# EAGLE design eae-pld-x (EAGLE 6.6.0)
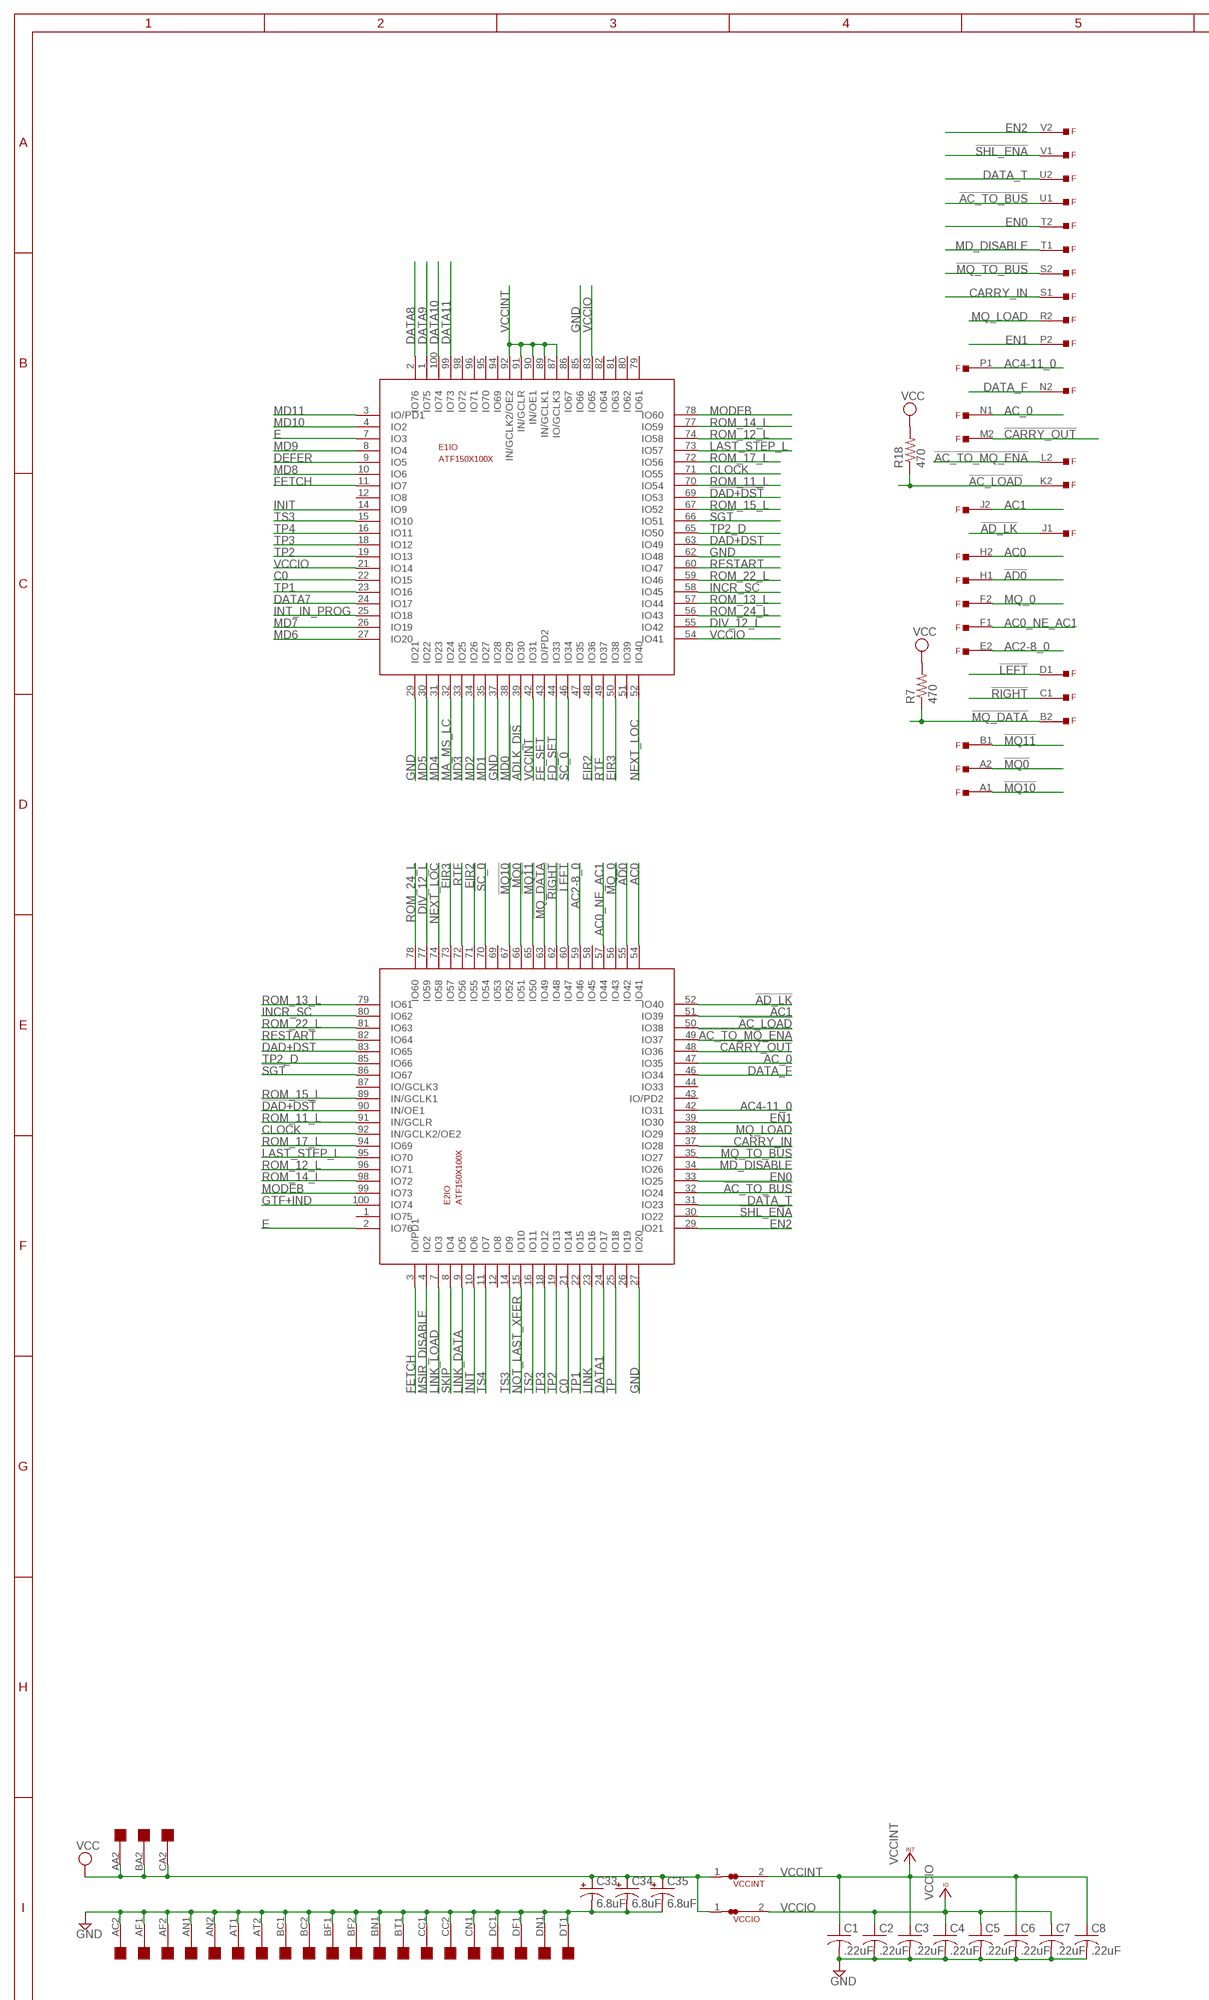
[diagram p0: schematic, sheet 1, part 1 of 2]
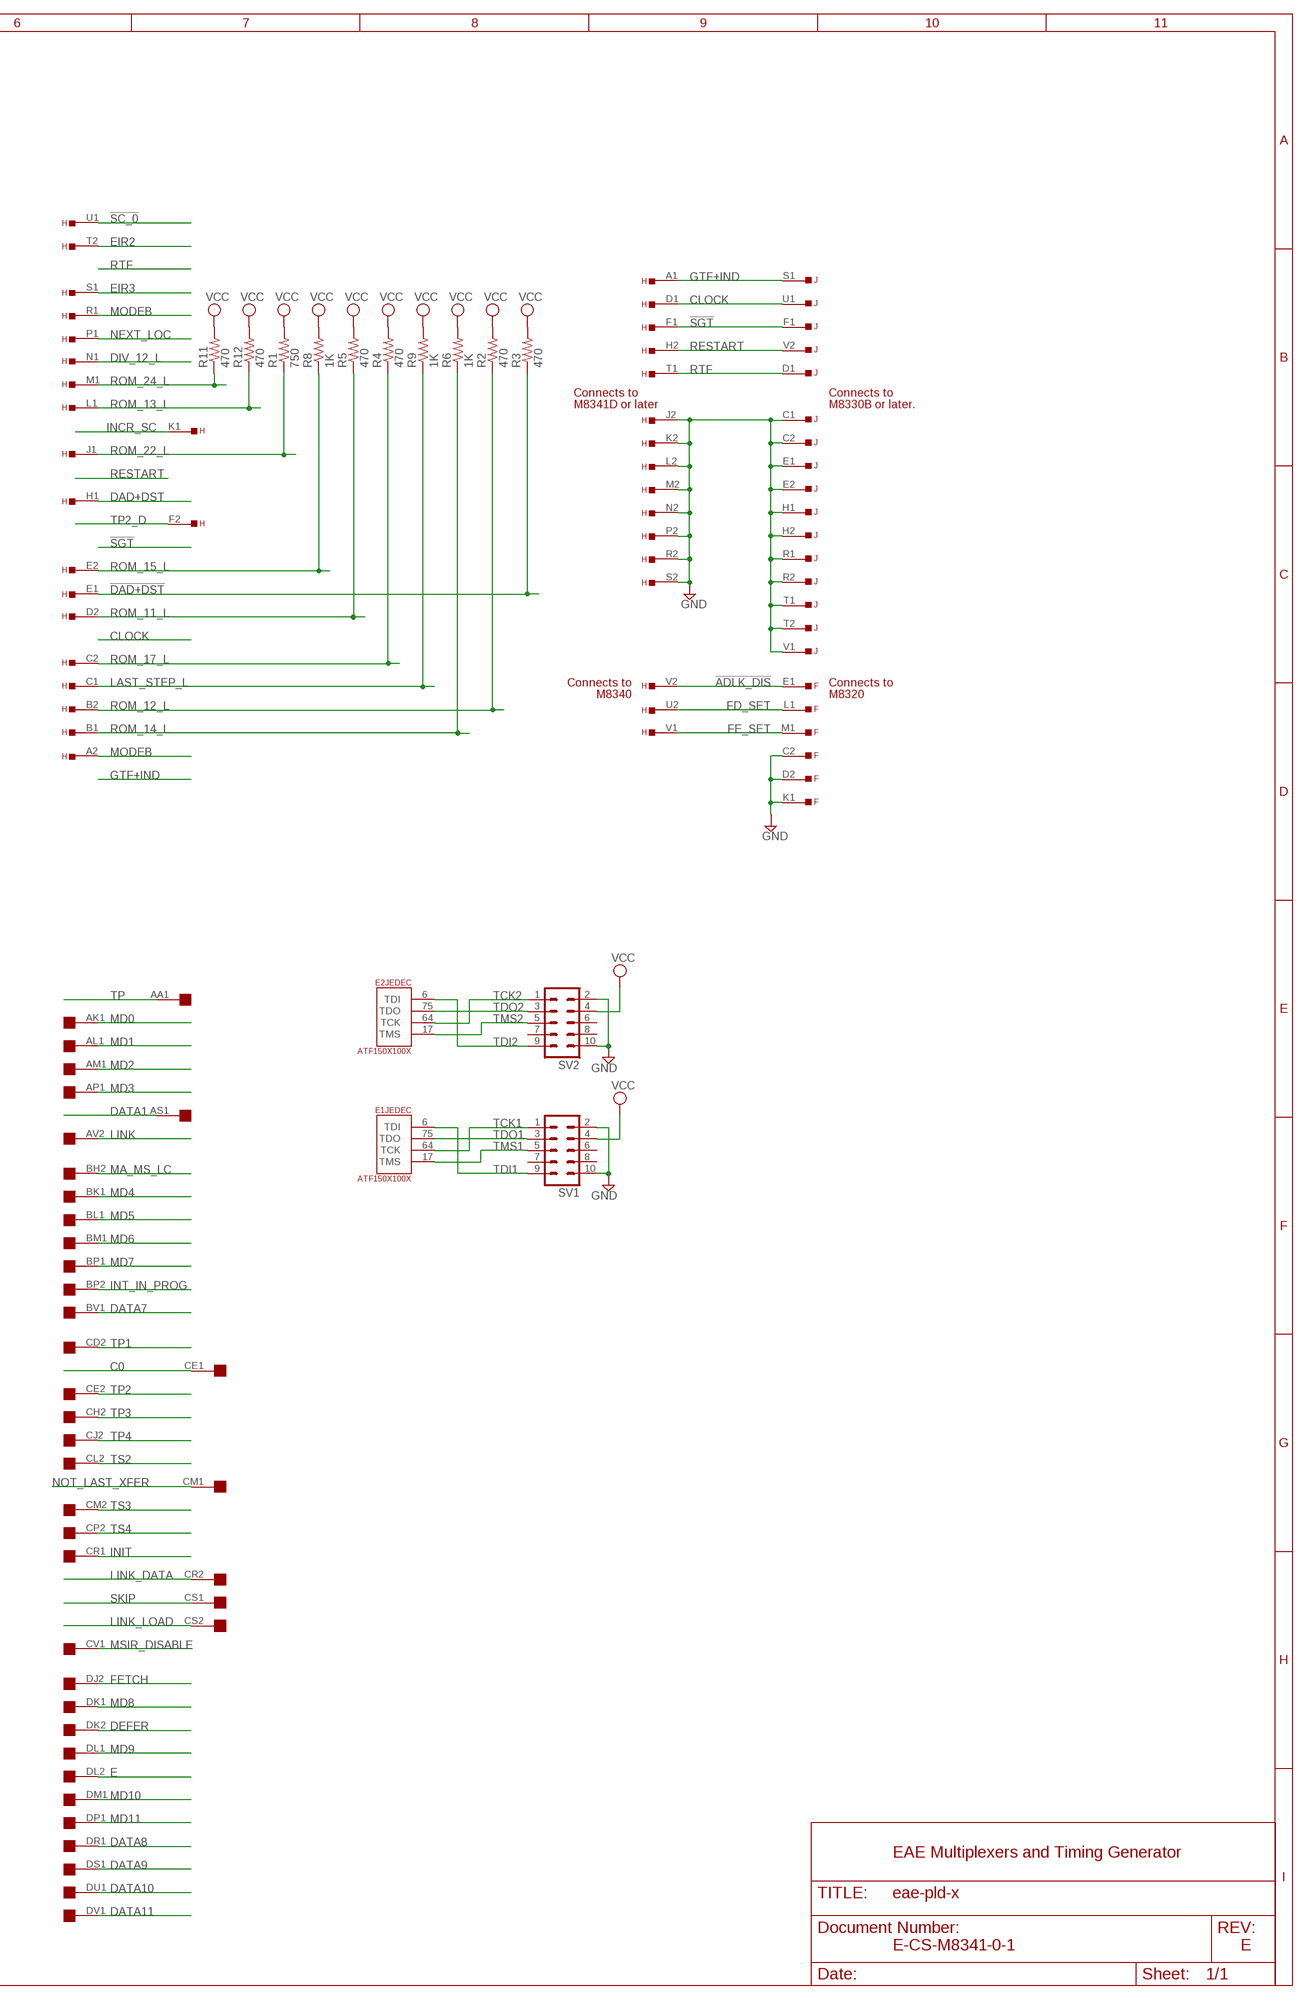
[diagram p1: schematic, sheet 1, part 2 of 2]

## Parts
C1  .22uF  C-US  [C063-025X075]
C2  .22uF  C-US  [C063-025X075]
C3  .22uF  C-US  [C063-025X075]
C4  .22uF  C-US  [C063-025X075]
C5  .22uF  C-US  [C063-025X075]
C6  .22uF  C-US  [C063-025X075]
C7  .22uF  C-US  [C063-025X075]
C8  .22uF  C-US  [C063-025X075]
C33  6.8uF  CPOL-USE20-8AXIAL  [E12-8]
C34  6.8uF  CPOL-USE20-8AXIAL  [E12-8]
C35  6.8uF  CPOL-USE20-8AXIAL  [E12-8]
E1  ATF150X100X  [TH100B]
E2  ATF150X100X  [TH100B]
F  EDGE-TOP  [EDGE-CON2]
H  EDGE-TOP  [EDGE-CON2]
J  EDGE-TOP  [EDGE-CON2]
R1  750  R-US_0207/10  [0207/10]
R2  470  R-US_0207/10  [0207/10]
R3  470  R-US_0207/10  [0207/10]
R4  470  R-US_0207/10  [0207/10]
R5  470  R-US_0207/10  [0207/10]
R6  1K  R-US_0207/10  [0207/10]
R7  470  R-US_0207/10  [0207/10]
R8  1K  R-US_0207/10  [0207/10]
R9  1K  R-US_0207/10  [0207/10]
R11  470  R-US_0207/10  [0207/10]
R12  470  R-US_0207/10  [0207/10]
R18  470  R-US_0207/10  [0207/10]
SV1  ML10  [ML10]
SV2  ML10  [ML10]
U$1  QUAD  [EDGE-CON8]
VCCINT  JUMPER-NC1  [NC1]
VCCIO  JUMPER-NC1  [NC1]

## Nets
!AC_LOAD: E2.50(IO:IO38) F.K2 R18.1
!AC_TO_BUS: E2.32(IO:IO24) F.U1
!AC_TO_MQ_ENA: E2.49(IO:IO37) F.L2
!AD0: E2.55(IO:IO42) F.H1
!AD_LK: E2.52(IO:IO40) F.J1
!ADLK_DIS: E1.39(IO:IO30) F.E1 H.V2
!CARRY_OUT: E2.48(IO:IO36) F.M2
!DAD+DST: E1.69(IO:IO53) E2.90(IO:IN/OE1) H.E1 R3.1
!LEFT: E2.60(IO:IO47) F.D1
!MQ0: E2.66(IO:IO51) F.A2
!MQ10: E2.67(IO:IO52) F.A1
!MQ11: E2.65(IO:IO50) F.B1
!MQ_DATA: E2.63(IO:IO49) F.B2 R7.1
!MQ_TO_BUS: E2.35(IO:IO27) F.S2
!RIGHT: E2.62(IO:IO48) F.C1
!SC_0: E1.46(IO:IO34) E2.70(IO:IO54) H.U1
!SGT: E1.66(IO:IO51) E2.86(IO:IO67) H.F1 J.F1
!SHL_ENA: E2.30(IO:IO22) F.V1
AC0: E2.54(IO:IO41) F.H2
AC0_NE_AC1: E2.57(IO:IO44) F.F1
AC1: E2.51(IO:IO39) F.J2
AC2-8_0: E2.59(IO:IO46) F.E2
AC4-11_0: E2.42(IO:IO31) F.P1
AC_0: E2.47(IO:IO35) F.N1
C0: E1.22(IO:IO15) E2.21(IO:IO14) U$1.CE1
CARRY_IN: E2.37(IO:IO28) F.S1
CLOCK: E1.71(IO:IO55) E2.92(IO:IN/GCLK2/OE2) H.D1 J.U1
DAD+DST: E1.63(IO:IO49) E2.83(IO:IO65) H.H1
DATA1: E2.24(IO:IO17) U$1.AS1
DATA7: E1.24(IO:IO17) U$1.BV1
DATA8: E1.2(IO:IO76) U$1.DR1
DATA9: E1.1(IO:IO75) U$1.DS1
DATA10: E1.100(IO:IO74) U$1.DU1
DATA11: E1.99(IO:IO73) U$1.DV1
DATA_F: E2.46(IO:IO34) F.N2
DATA_T: E2.31(IO:IO23) F.U2
DEFER: E1.9(IO:IO5) U$1.DK2
DIV_12_L: E1.55(IO:IO42) E2.77(IO:IO59) H.N1
E: E1.7(IO:IO3) E2.2(IO:IO76) U$1.DL2
EIR2: E1.48(IO:IO36) E2.71(IO:IO55) H.T2
EIR3: E1.50(IO:IO38) E2.73(IO:IO57) H.S1
EN0: E2.33(IO:IO25) F.T2
EN1: E2.39(IO:IO30) F.P2
EN2: E2.29(IO:IO21) F.V2
FD_SET: E1.44(IO:IO33) F.L1 H.U2
FE_SET: E1.43(IO:IO/PD2) F.M1 H.V1
FETCH: E1.11(IO:IO7) E2.3(IO:IO/PD1) U$1.DJ2
GND [supply]: C1.2 C2.2 C3.2 C4.2 C5.2 C6.2 C7.2 C8.2 C33.- C34.- C35.- E1.29(IO:IO21) E1.37(IO:IO28) E1.62(IO:IO48) E1.85(IO:IO66) E2.27(IO:IO20) F.C2 F.D2 F.K1 H.J2 H.K2 H.L2 H.M2 H.N2 H.P2 H.R2 H.S2 J.C1 J.C2 J.E1 J.E2 J.H1 J.H2 J.R1 J.R2 J.T1 J.T2 J.V1 SV1.2 SV1.10 SV2.2 SV2.10 U$1.AC2 U$1.AF1 U$1.AF2 U$1.AN1 U$1.AN2 U$1.AT1 U$1.AT2 U$1.BC1 U$1.BC2 U$1.BF1 U$1.BF2 U$1.BN1 U$1.BT1 U$1.CC1 U$1.CC2 U$1.CN1 U$1.DC1 U$1.DF1 U$1.DN1 U$1.DT1
GTF+IND: E2.100(IO:IO74) H.A1 J.S1
INCR_SC: E1.58(IO:IO45) E2.80(IO:IO62) H.K1
INIT: E1.14(IO:IO9) E2.10(IO:IO6) U$1.CR1
INT_IN_PROG: E1.25(IO:IO18) U$1.BP2
LAST_STEP_L: E1.73(IO:IO57) E2.95(IO:IO70) H.C1 R9.1
LINK: E2.23(IO:IO16) U$1.AV2
LINK_DATA: E2.9(IO:IO5) U$1.CR2
LINK_LOAD: E2.7(IO:IO3) U$1.CS2
MA_MS_LC: E1.32(IO:IO24) U$1.BH2
MD0: E1.38(IO:IO29) U$1.AK1
MD1: E1.35(IO:IO27) U$1.AL1
MD2: E1.34(IO:IO26) U$1.AM1
MD3: E1.33(IO:IO25) U$1.AP1
MD4: E1.31(IO:IO23) U$1.BK1
MD5: E1.30(IO:IO22) U$1.BL1
MD6: E1.27(IO:IO20) U$1.BM1
MD7: E1.26(IO:IO19) U$1.BP1
MD8: E1.10(IO:IO6) U$1.DK1
MD9: E1.8(IO:IO4) U$1.DL1
MD10: E1.4(IO:IO2) U$1.DM1
MD11: E1.3(IO:IO/PD1) U$1.DP1
MD_DISABLE: E2.34(IO:IO26) F.T1
MODEB: E1.78(IO:IO60) E2.99(IO:IO73) H.A2 H.R1
MQ_0: E2.56(IO:IO43) F.F2
MQ_LOAD: E2.38(IO:IO29) F.R2
MSIR_DISABLE: E2.4(IO:IO2) U$1.CV1
NEXT_LOC: E1.52(IO:IO40) E2.74(IO:IO58) H.P1
NOT_LAST_XFER: E2.15(IO:IO10) U$1.CM1
RESTART: E1.60(IO:IO47) E2.82(IO:IO64) H.H2 J.V2
ROM_11_L: E1.70(IO:IO54) E2.91(IO:IN/GCLR) H.D2 R5.1
ROM_12_L: E1.74(IO:IO58) E2.96(IO:IO71) H.B2 R2.1
ROM_13_L: E1.57(IO:IO44) E2.79(IO:IO61) H.L1 R12.1
ROM_14_L: E1.77(IO:IO59) E2.98(IO:IO72) H.B1 R6.1
ROM_15_L: E1.67(IO:IO52) E2.89(IO:IN/GCLK1) H.E2 R8.1
ROM_17_L: E1.72(IO:IO56) E2.94(IO:IO69) H.C2 R4.1
ROM_22_L: E1.59(IO:IO46) E2.81(IO:IO63) H.J1 R1.1
ROM_24_L: E1.56(IO:IO43) E2.78(IO:IO60) H.M1 R11.1
RTF: E1.49(IO:IO37) E2.72(IO:IO56) H.T1 J.D1
SKIP: E2.8(IO:IO4) U$1.CS1
TCK1: E1.64(JEDEC:TCK) SV1.1
TCK2: E2.64(JEDEC:TCK) SV2.1
TDI1: E1.6(JEDEC:TDI) SV1.9
TDI2: E2.6(JEDEC:TDI) SV2.9
TDO1: E1.75(JEDEC:TDO) SV1.3
TDO2: E2.75(JEDEC:TDO) SV2.3
TMS1: E1.17(JEDEC:TMS) SV1.5
TMS2: E2.17(JEDEC:TMS) SV2.5
TP: E2.25(IO:IO18) U$1.AA1
TP1: E1.23(IO:IO16) E2.22(IO:IO15) U$1.CD2
TP2: E1.19(IO:IO13) E2.19(IO:IO13) U$1.CE2
TP2_D: E1.65(IO:IO50) E2.85(IO:IO66) H.F2
TP3: E1.18(IO:IO12) E2.18(IO:IO12) U$1.CH2
TP4: E1.16(IO:IO11) U$1.CJ2
TS2: E2.16(IO:IO11) U$1.CL2
TS3: E1.15(IO:IO10) E2.14(IO:IO9) U$1.CM2
TS4: E2.11(IO:IO7) U$1.CP2
VCC [supply]: C33.+ C34.+ C35.+ R1.2 R2.2 R3.2 R4.2 R5.2 R6.2 R7.2 R8.2 R9.2 R11.2 R12.2 R18.2 SV1.4 SV2.4 U$1.AA2 U$1.BA2 U$1.CA2 VCCINT.1 VCCIO.1
VCCINT [supply]: C1.1 C3.1 C6.1 C8.1 E1.42(IO:IO31) E1.87(IO:IO/GCLK3) E1.89(IO:IN/GCLK1) E1.90(IO:IN/OE1) E1.91(IO:IN/GCLR) E1.92(IO:IN/GCLK2/OE2) VCCINT.2
VCCIO [supply]: C2.1 C4.1 C5.1 C7.1 E1.21(IO:IO14) E1.54(IO:IO41) E1.83(IO:IO65) VCCIO.2
Unconnected: E1.12(IO:IO8) E1.47(IO:IO35) E1.51(IO:IO39) E1.79(IO:IO61) E1.80(IO:IO62) E1.81(IO:IO63) E1.82(IO:IO64) E1.86(IO:IO67) E1.94(IO:IO69) E1.95(IO:IO70) E1.96(IO:IO71) E1.98(IO:IO72) E2.1(IO:IO75) E2.12(IO:IO8) E2.26(IO:IO19) E2.43(IO:IO/PD2) E2.44(IO:IO33) E2.58(IO:IO45) E2.69(IO:IO53) E2.87(IO:IO/GCLK3) F.R1 J.A1 J.A2 J.B1 J.B2 J.D2 J.F2 J.J1 J.J2 J.K1 J.K2 J.L1 J.L2 J.M1 J.M2 J.N1 J.N2 J.P1 J.P2 J.S2 J.U2 SV1.6 SV1.7 SV1.8 SV2.6 SV2.7 SV2.8 U$1.AB1 U$1.AB2 U$1.AC1 U$1.AD1 U$1.AD2 U$1.AE1 U$1.AE2 U$1.AH1 U$1.AH2 U$1.AJ1 U$1.AJ2 U$1.AK2 U$1.AL2 U$1.AM2 U$1.AP2 U$1.AR1 U$1.AR2 U$1.AS2 U$1.AU1 U$1.AU2 U$1.AV1 U$1.BA1 U$1.BB1 U$1.BB2 U$1.BD1 U$1.BD2 U$1.BE1 U$1.BE2 U$1.BH1 U$1.BJ1 U$1.BJ2 U$1.BK2 U$1.BL2 U$1.BM2 U$1.BN2 U$1.BR1 U$1.BR2 U$1.BS1 U$1.BS2 U$1.BT2 U$1.BU1 U$1.BU2 U$1.BV2 U$1.CA1 U$1.CB1 U$1.CB2 U$1.CD1 U$1.CF1 U$1.CF2 U$1.CH1 U$1.CJ1 U$1.CK1 U$1.CK2 U$1.CL1 U$1.CN2 U$1.CP1 U$1.CT1 U$1.CT2 U$1.CU1 U$1.CU2 U$1.CV2 U$1.DA1 U$1.DA2 U$1.DB1 U$1.DB2 U$1.DC2 U$1.DD1 U$1.DD2 U$1.DE1 U$1.DE2 U$1.DF2 U$1.DH1 U$1.DH2 U$1.DJ1 U$1.DM2 U$1.DN2 U$1.DP2 U$1.DR2 U$1.DS2 U$1.DT2 U$1.DU2 U$1.DV2

## Notes on the sheet
- Connects to | Connects to
- M8341D or later | M8330B or later.
- Connects to | Connects to
- M8340 | M8320
- EAE Multiplexers and Timing Generator
- E-CS-M8341-0-1 | E

## Power pins joined to a net without a drawn wire
GND: E1.13(GND) E1.28(GND) E1.40(GND) E1.45(GND) E1.61(GND) E1.76(GND) E1.88(GND) E1.97(GND) E1.P$24(GND) E1.P$26(GND) E1.P$28(GND) E1.P$30(GND) E2.13(GND) E2.28(GND) E2.40(GND) E2.45(GND) E2.61(GND) E2.76(GND) E2.88(GND) E2.97(GND) E2.P$24(GND) E2.P$26(GND) E2.P$28(GND) E2.P$30(GND)
VCCINT: E1.41(VCCINT) E1.93(VCCINT) E1.P$23(VCCINT) E1.P$25(VCCINT) E2.41(VCCINT) E2.93(VCCINT) E2.P$23(VCCINT) E2.P$25(VCCINT)
VCCIO: E1.5(VCCIO) E1.20(VCCIO) E1.36(VCCIO) E1.53(VCCIO) E1.68(VCCIO) E1.84(VCCIO) E1.P$27(VCCIO) E1.P$29(VCCIO) E1.VCCIO@1(VCCIO) E1.VCCIO@2(VCCIO) E2.5(VCCIO) E2.20(VCCIO) E2.36(VCCIO) E2.53(VCCIO) E2.68(VCCIO) E2.84(VCCIO) E2.P$27(VCCIO) E2.P$29(VCCIO) E2.VCCIO@1(VCCIO) E2.VCCIO@2(VCCIO)

## Library data of the parts
C1-C8 = dec-con:C-US: Capacitors with funky DEC lead spacing.
C33-C35 = dec-con:CPOL-USE20-8AXIAL: A 0.8 inch electrolytic.
E1 E2 = atmel-cpld:ATF150X100: ATF150x in 100 pin package.
F H J = dec-con:EDGE-TOP: Labeled DEC edge connector, suitable for top connector.
R1-R9 R11 R12 R18 = rcl:R-US_: RESISTOR, American symbol
SV1 SV2 = con-harting-ml:ML10: HARTING; OC_FARNELL: unknown; OC_NEWARK: unknown
U$1 = dec-con:QUAD: Quad-Height DEC board
VCCINT VCCIO = dec-con:JUMPER: Normally closed SMD Jumper (Generates a DRC error.)

## Net classes
0 default: width 0.381 mm
1 supply: width 0.381 mm

## Board
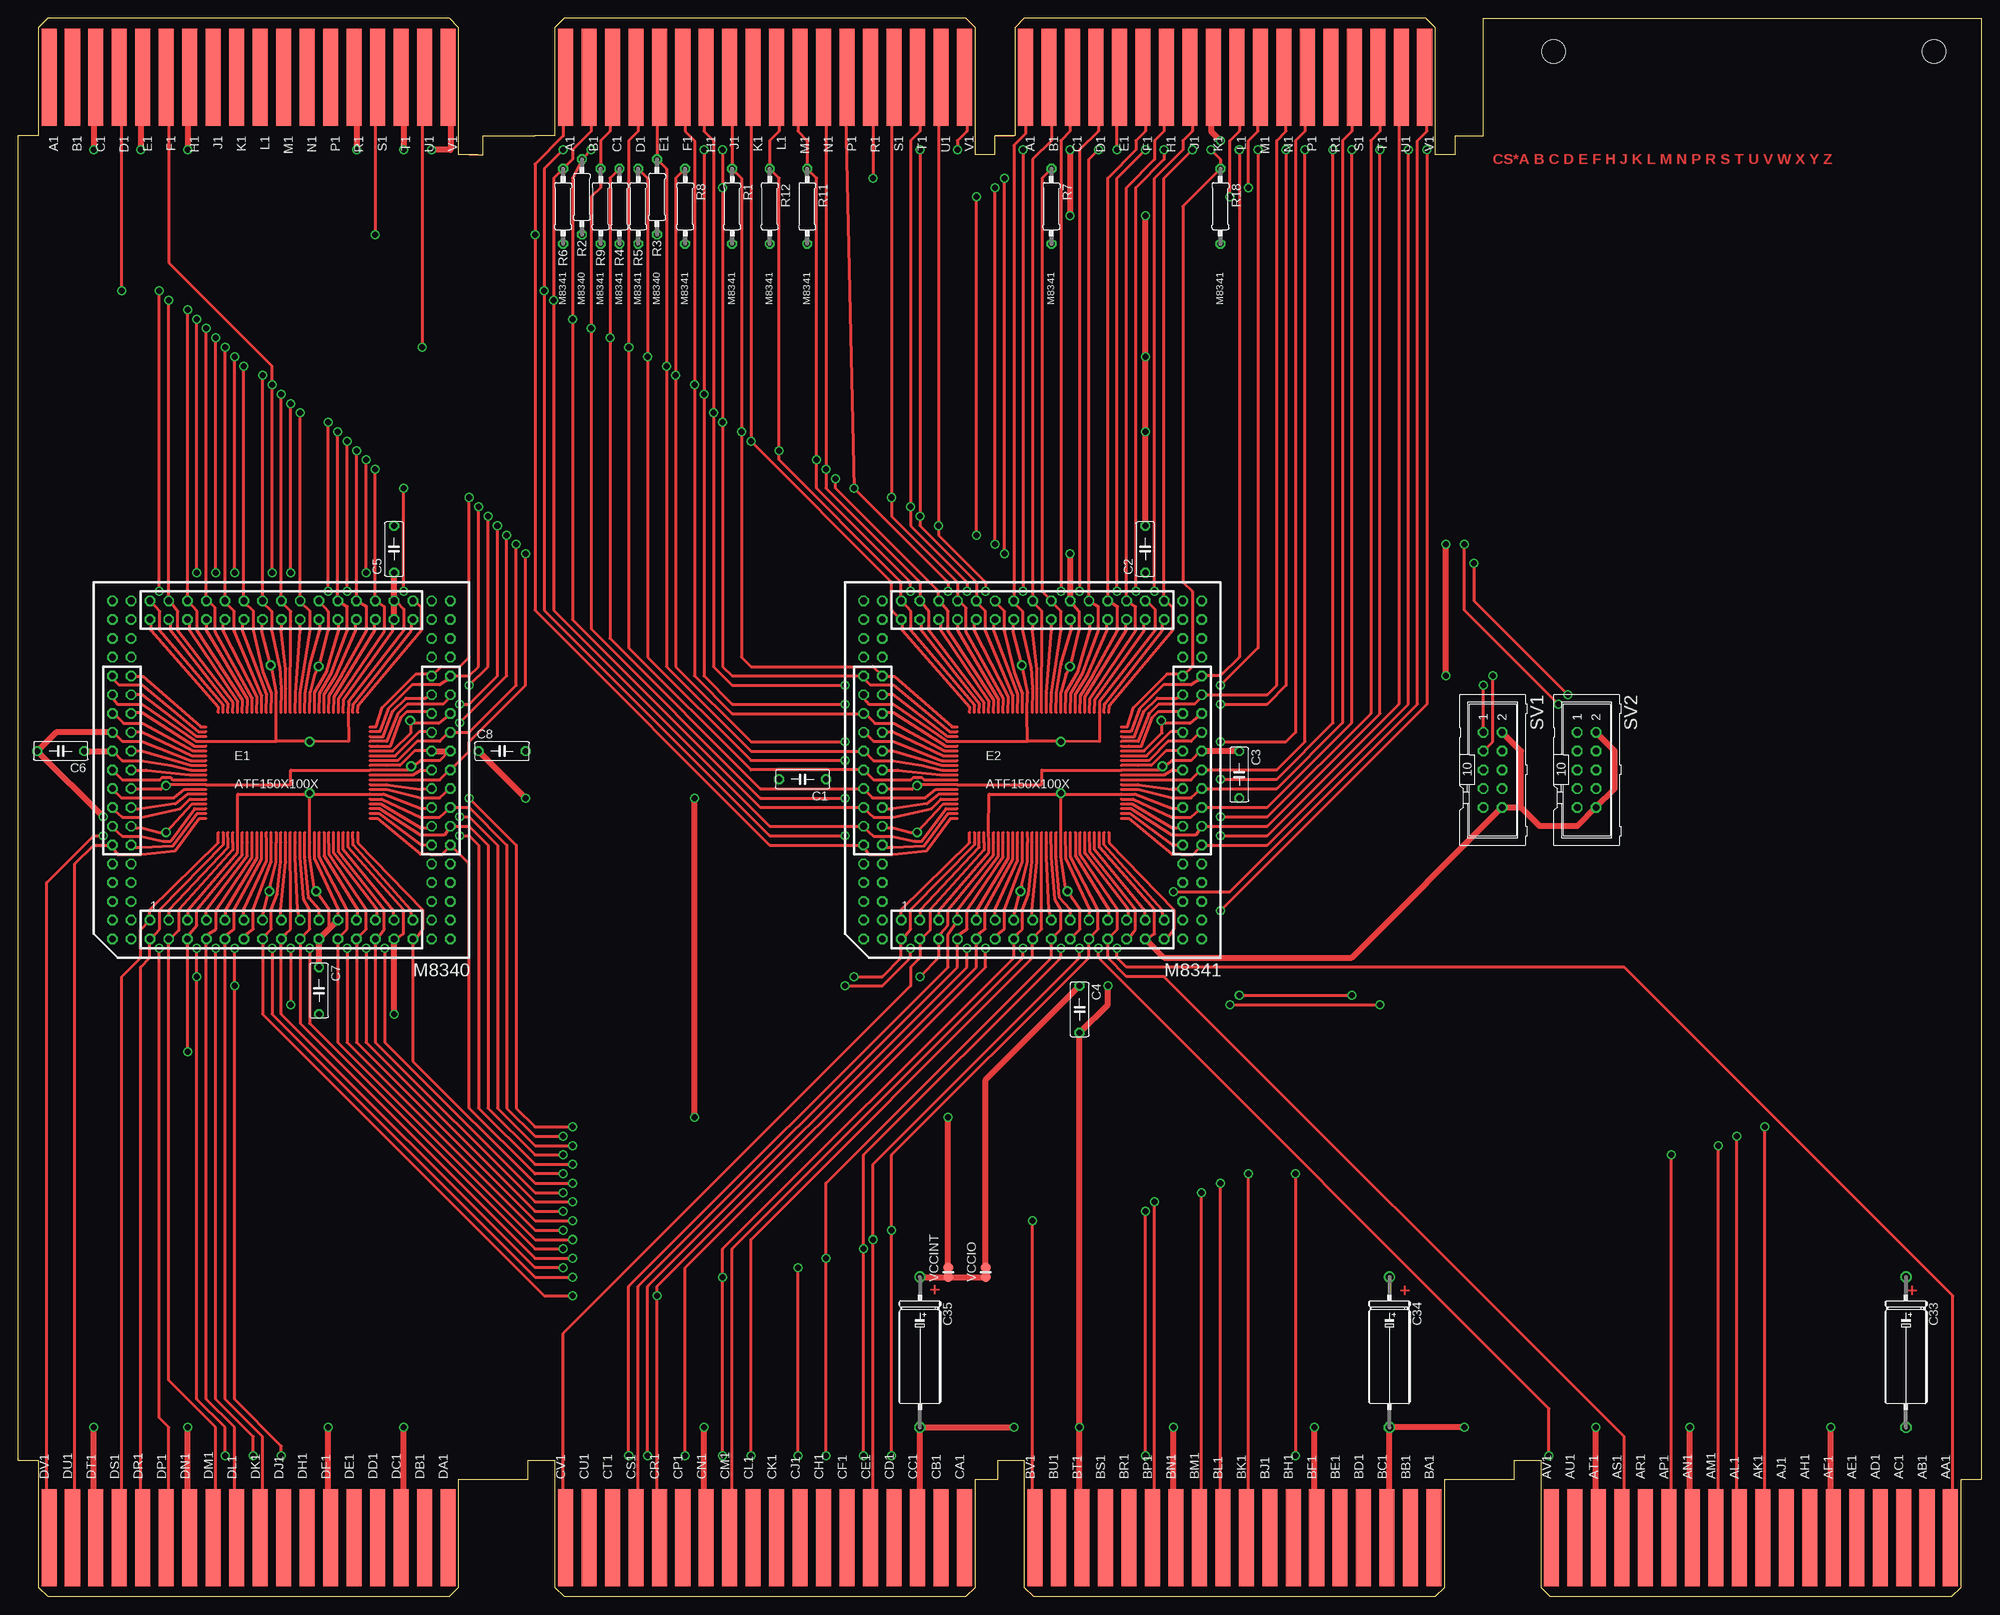
[diagram p2: board, top side]
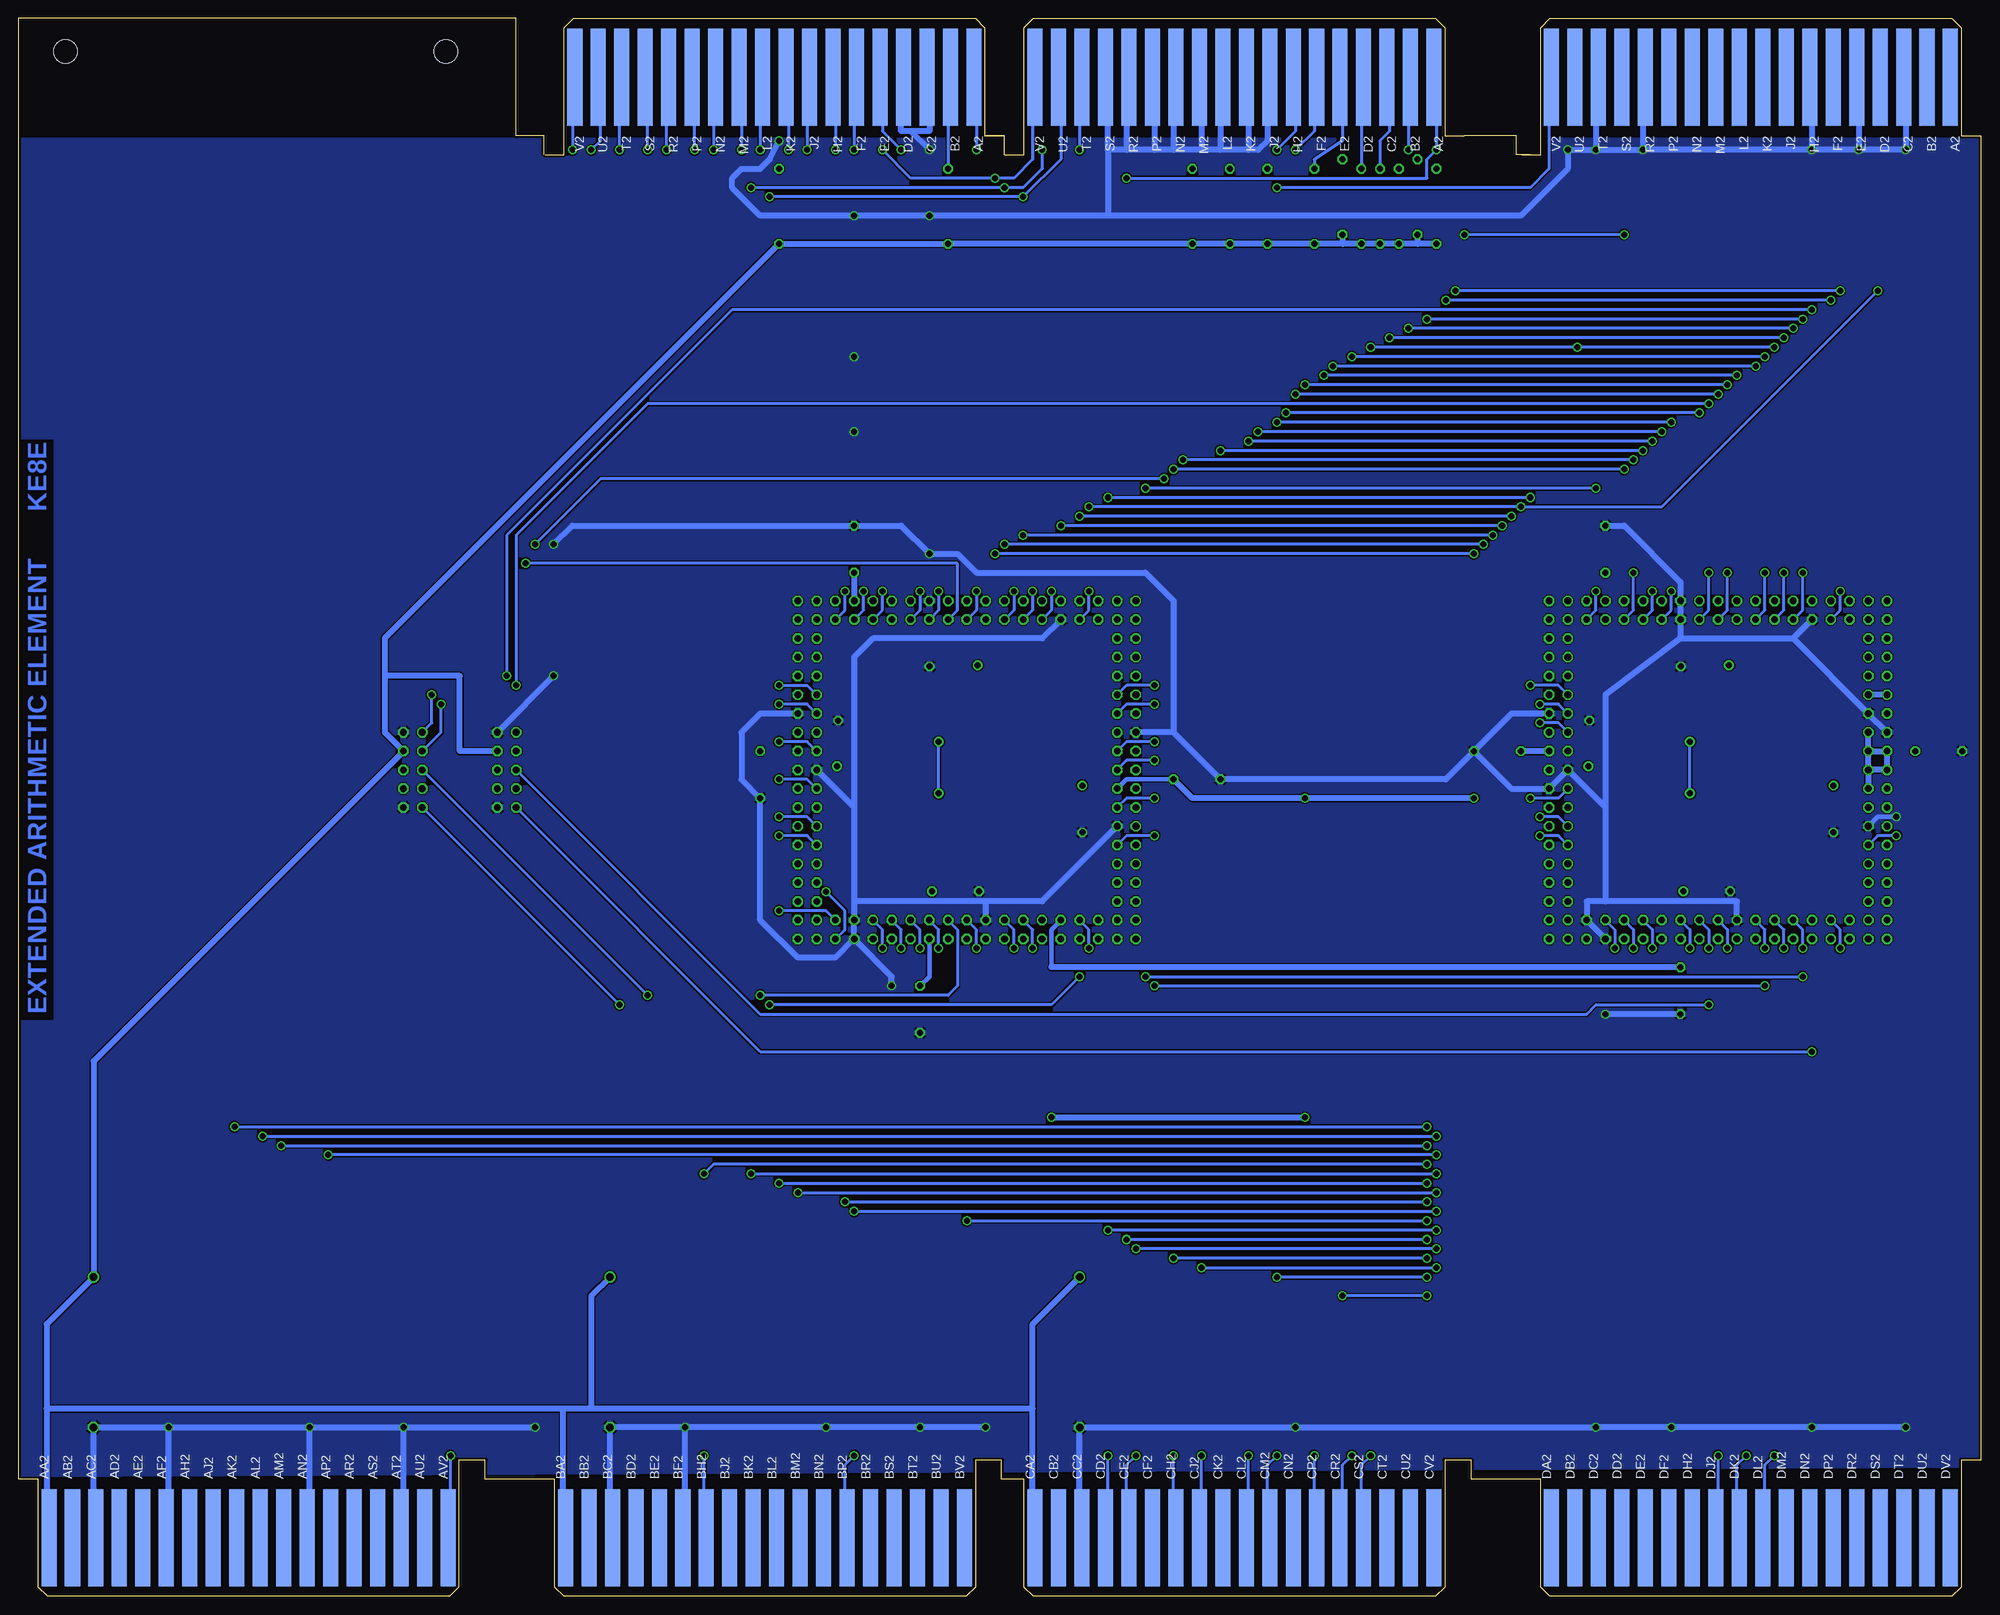
[diagram p3: board, bottom side, seen from below]

Size 265.43 x 213.36 mm. Coordinates in mm from the lower left corner, seen from the top.
Outline: 265.43,15.88 265.43,213.36 198.12,213.36 198.12,197.49 194.31,197.49 194.31,194.94
Outline: 0,197.49 0,18.41 0.64,18.41
Outline: 131.76,194.94 132.08,194.94 132.08,197.49 134.62,197.49
Outline: 60.96,194.94 62.87,194.94 62.87,197.49 69.85,197.49
Copper layers (1+16): Top 0.035mm / dielectric 1.5mm / Bottom 0.035mm
Design rules "16mils *": minimum track width 16mil, minimum drill 32mil, track to track 7mil, track to pad 8mil, pad to pad 8mil, via to via 10mil, smd to smd 7mil, copper to edge 13mil, drill to drill 10mil, minimum pad ring 10mil, minimum via ring 8mil, stop-mask expansion 0mil, vias tented up to drill 0mil, thermal gap 10mil
Holes 3.2 mm at 207.65,208.91 259.08,208.91

### Footprints (pad centres in the part's own frame; a part is rotated, then mirrored left to right if it is on the bottom)
C063-025X075 = drill 0.813 octagon: 1 -2.54,0; 2 3.81,0
E12-8 = drill 1.016: + -10.16,0 | drill 1.016 octagon: - 10.16,0
TH100B = drill 0.9 octagon: 1 -17.78,-20.32; 2 -17.78,-22.86; 3 -15.24,-20.32; 4 -15.24,-22.86; 5 -12.7,-20.32; 6 -12.7,-22.86; 7 -10.16,-20.32; 8 -10.16,-22.86; 9 -7.62,-20.32; 10 -7.62,-22.86; 11 -5.08,-20.32; 12 -5.08,-22.86; 13 -2.54,-20.32; 14 -2.54,-22.86; 15 0,-20.32; 16 0,-22.86; 17 2.54,-20.32; 18 2.54,-22.86; 19 5.08,-20.32; 20 5.08,-22.86; 21 7.62,-20.32; 22 7.62,-22.86; 23 10.16,-20.32; 24 10.16,-22.86; 25 12.7,-20.32; 26 12.7,-22.86; 27 15.24,-20.32; 28 15.24,-22.86; 29 17.78,-20.32; 30 17.78,-22.86; 31 22.86,-10.16; 32 20.32,-10.16; 33 22.86,-7.62; 34 20.32,-7.62; 35 22.86,-5.08; 36 20.32,-5.08; 37 22.86,-2.54; 38 20.32,-2.54; 39 22.86,0; 40 20.32,0; 41 22.86,2.54; 42 20.32,2.54; 43 22.86,5.08; 44 20.32,5.08; 45 22.86,7.62; 46 20.32,7.62; 47 22.86,10.16; 48 20.32,10.16; 49 22.86,12.7; 50 20.32,12.7; 51 17.78,22.86; 52 17.78,20.32; 53 15.24,22.86; 54 15.24,20.32; 55 12.7,22.86; 56 12.7,20.32; 57 10.16,22.86; 58 10.16,20.32; 59 7.62,22.86; 60 7.62,20.32; 61 5.08,22.86; 62 5.08,20.32; 63 2.54,22.86; 64 2.54,20.32; 65 0,22.86; 66 0,20.32; 67 -2.54,22.86; 68 -2.54,20.32; 69 -5.08,22.86; 70 -5.08,20.32; 71 -7.62,22.86; 72 -7.62,20.32; 73 -10.16,22.86; 74 -10.16,20.32; 75 -12.7,22.86; 76 -12.7,20.32; 77 -15.24,22.86; 78 -15.24,20.32; 79 -17.78,22.86; 80 -17.78,20.32; 81 -20.32,12.7; 82 -22.86,12.7; 83 -20.32,10.16; 84 -22.86,10.16; 85 -20.32,7.62; 86 -22.86,7.62; 87 -20.32,5.08; 88 -22.86,5.08; 89 -20.32,2.54; 90 -22.86,2.54; 91 -20.32,0; 92 -22.86,0; 93 -20.32,-2.54; 94 -22.86,-2.54; 95 -20.32,-5.08; 96 -22.86,-5.08; 97 -20.32,-7.62; 98 -22.86,-7.62; 99 -20.32,-10.16; 100 -22.86,-10.16; P$1 -22.86,15.24; P$2 -20.32,15.24; P$3 -20.32,17.78; P$4 -22.86,17.78; P$5 -20.32,20.32; P$6 -22.86,20.32; P$7 -22.86,22.86; P$8 -20.32,22.86; P$9 20.32,15.24; P$10 22.86,15.24; P$11 20.32,17.78; P$12 22.86,17.78; P$13 20.32,20.32; P$14 22.86,20.32; P$15 20.32,22.86; P$16 22.86,22.86; P$17 20.32,-17.78; P$18 22.86,-17.78; P$19 20.32,-15.24; P$20 22.86,-15.24; P$21 20.32,-12.7; P$22 22.86,-12.7; P$31 20.32,-22.86; P$32 22.86,-22.86; P$33 22.86,-20.32; P$34 20.32,-20.32; P$35 -20.32,-22.86; P$36 -20.32,-20.32; P$37 -22.86,-20.32; P$38 -22.86,-22.86; P$39 -22.86,-17.78; P$40 -20.32,-17.78; P$41 -22.86,-15.24; P$42 -20.32,-15.24; P$43 -22.86,-12.7; P$44 -20.32,-12.7 | drill 0.813: P$23 17.556,0.488; P$24 17.394,6.665; P$25 -15.606,-2.113; P$26 -15.606,-8.453; P$27 4.714,-16.419; P$28 -1.626,-16.419; P$29 -1.463,14.143; P$30 5.039,13.98; VCCIO@1 3.81,3.81; VCCIO@2 3.81,-3.175
EDGE-CON2 = smd 13.106 x 2.032: A1 7.938,4.128; B1 7.938,7.303; C1 7.938,10.477; D1 7.938,13.652; E1 7.938,16.828; F1 7.938,20.003; H1 7.938,23.177; J1 7.938,26.352; K1 7.938,29.527; L1 7.938,32.703; M1 7.938,35.877; N1 7.938,39.053; P1 7.938,42.227; R1 7.938,45.403; S1 7.938,48.578; T1 7.938,51.752; U1 7.938,54.928; V1 7.938,58.102 | smd 13.106 x 2.032 bottom: A2 7.938,4.128; B2 7.938,7.303; C2 7.938,10.477; D2 7.938,13.652; E2 7.938,16.828; F2 7.938,20.003; H2 7.938,23.177; J2 7.938,26.352; K2 7.938,29.527; L2 7.938,32.703; M2 7.938,35.877; N2 7.938,39.053; P2 7.938,42.227; R2 7.938,45.403; S2 7.938,48.578; T2 7.938,51.752; U2 7.938,54.928; V2 7.938,58.102
0207/10 = drill 0.813 octagon: 1 -5.08,0; 2 5.08,0
ML10 = drill 0.914 octagon: 1 -5.08,-1.27; 2 -5.08,1.27; 3 -2.54,-1.27; 4 -2.54,1.27; 5 0,-1.27; 6 0,1.27; 7 2.54,-1.27; 8 2.54,1.27; 9 5.08,-1.27; 10 5.08,1.27
EDGE-CON8 = smd 2.032 x 13.106: AA1 261.303,7.938; AB1 258.127,7.938; AC1 254.952,7.938; AD1 251.778,7.938; AE1 248.602,7.938; AF1 245.428,7.938; AH1 242.252,7.938; AJ1 239.077,7.938; AK1 235.903,7.938; AL1 232.727,7.938; AM1 229.553,7.938; AN1 226.377,7.938; AP1 223.202,7.938; AR1 220.028,7.938; AS1 216.852,7.938; AT1 213.678,7.938; AU1 210.502,7.938; AV1 207.327,7.938; BA1 191.452,7.938; BB1 188.278,7.938; BC1 185.102,7.938; BD1 181.928,7.938; BE1 178.752,7.938; BF1 175.577,7.938; BH1 172.403,7.938; BJ1 169.227,7.938; BK1 166.053,7.938; BL1 162.877,7.938; BM1 159.702,7.938; BN1 156.528,7.938; BP1 153.352,7.938; BR1 150.178,7.938; BS1 147.002,7.938; BT1 143.827,7.938; BU1 140.653,7.938; BV1 137.477,7.938; CA1 127.953,7.938; CB1 124.778,7.938; CC1 121.603,7.938; CD1 118.427,7.938; CE1 115.252,7.938; CF1 112.078,7.938; CH1 108.903,7.938; CJ1 105.728,7.938; CK1 102.552,7.938; CL1 99.377,7.938; CM1 96.203,7.938; CN1 93.028,7.938; CP1 89.853,7.938; CR1 86.677,7.938; CS1 83.502,7.938; CT1 80.328,7.938; CU1 77.153,7.938; CV1 73.978,7.938; DA1 58.102,7.938; DB1 54.928,7.938; DC1 51.752,7.938; DD1 48.578,7.938; DE1 45.403,7.938; DF1 42.227,7.938; DH1 39.053,7.938; DJ1 35.877,7.938; DK1 32.703,7.938; DL1 29.527,7.938; DM1 26.352,7.938; DN1 23.177,7.938; DP1 20.003,7.938; DR1 16.828,7.938; DS1 13.652,7.938; DT1 10.477,7.938; DU1 7.303,7.938; DV1 4.128,7.938 | smd 2.032 x 13.106 bottom: AA2 261.303,7.938; AB2 258.127,7.938; AC2 254.952,7.938; AD2 251.778,7.938; AE2 248.602,7.938; AF2 245.428,7.938; AH2 242.252,7.938; AJ2 239.077,7.938; AK2 235.903,7.938; AL2 232.727,7.938; AM2 229.553,7.938; AN2 226.377,7.938; AP2 223.202,7.938; AR2 220.028,7.938; AS2 216.852,7.938; AT2 213.678,7.938; AU2 210.502,7.938; AV2 207.327,7.938; BA2 191.452,7.938; BB2 188.278,7.938; BC2 185.102,7.938; BD2 181.928,7.938; BE2 178.752,7.938; BF2 175.577,7.938; BH2 172.403,7.938; BJ2 169.227,7.938; BK2 166.053,7.938; BL2 162.877,7.938; BM2 159.702,7.938; BN2 156.528,7.938; BP2 153.352,7.938; BR2 150.178,7.938; BS2 147.002,7.938; BT2 143.827,7.938; BU2 140.653,7.938; BV2 137.477,7.938; CA2 127.953,7.938; CB2 124.778,7.938; CC2 121.603,7.938; CD2 118.427,7.938; CE2 115.252,7.938; CF2 112.078,7.938; CH2 108.903,7.938; CJ2 105.728,7.938; CK2 102.552,7.938; CL2 99.377,7.938; CM2 96.203,7.938; CN2 93.028,7.938; CP2 89.853,7.938; CR2 86.677,7.938; CS2 83.502,7.938; CT2 80.328,7.938; CU2 77.153,7.938; CV2 73.978,7.938; DA2 58.102,7.938; DB2 54.928,7.938; DC2 51.752,7.938; DD2 48.578,7.938; DE2 45.403,7.938; DF2 42.227,7.938; DH2 39.053,7.938; DJ2 35.877,7.938; DK2 32.703,7.938; DL2 29.527,7.938; DM2 26.352,7.938; DN2 23.177,7.938; DP2 20.003,7.938; DR2 16.828,7.938; DS2 13.652,7.938; DT2 10.477,7.938; DU2 7.303,7.938; DV2 4.128,7.938
NC1 = smd 1.346 x 1.346: 1 -0.635,0; 2 0.635,0

### Placement (x,y rotation side)
C1  106.68,110.49 180 top
C2  152.4,140.97 90 top
C3  165.1,111.76 270 top
C4  143.51,80.01 270 top
C5  50.8,140.97 90 top
C6  6.35,114.3 180 top
C7  40.64,82.55 270 top
C8  64.77,114.3 0 top
C33  255.27,33.02 270 top
C34  185.42,33.02 270 top
C35  121.92,33.02 270 top
E1  35.56,111.76 0 top
E2  137.16,111.76 0 top
F  132.08,213.36 270 top
H  69.85,213.36 270 top
J  0,213.36 270 top
R1  96.52,187.96 270 top
R2  76.2,189.23 270 top
R3  86.36,189.23 270 top
R4  81.28,187.96 270 top
R5  83.82,187.96 270 top
R6  73.66,187.96 270 top
R7  139.7,187.96 270 top
R8  90.17,187.96 270 top
R9  78.74,187.96 270 top
R11  106.68,187.96 270 top
R12  101.6,187.96 270 top
R18  162.56,187.96 270 top
SV1  199.39,111.76 270 top
SV2  212.09,111.76 270 top
U$1  0,0 0 top
VCCINT  125.73,43.81 90 top
VCCIO  130.81,43.81 90 top

### Tracks (layer width: path | path; a pad name or v marks a point on that pad's centre or on a via)
!AC_LOAD  (via drill 0.81)
  Top 0.406: v161.29,195.58 162.56,194.31 R18.1 157.48,187.96 157.48,137.16 158.75,135.89 158.75,125.73 E2.50
  Bottom 0.406: F.K2 161.61,203.52 161.29,203.2 v161.29,195.58
!AC_TO_BUS  (via drill 0.81)
  Top 0.406: v162.56,102.87 168.91,102.87 186.69,120.65 186.69,204.47 187.01,204.79 F.U1
  Bottom 0.406: E2.32 158.75,102.87 v162.56,102.87
!AC_TO_MQ_ENA  (via drill 0.81)
  Top 0.406: v165.1,195.58 165.1,127 162.56,124.46 E2.49
  Bottom 0.406: F.L2 164.78,203.52 165.1,203.2 v165.1,195.58
!AD0
  Top 0.406: E2.55 149.86,190.5 153.67,194.31 153.67,196.85 154.94,198.12 154.94,203.2 155.26,203.52 F.H1
!AD_LK  (via drill 0.81)
  Top 0.406: v153.67,135.89 153.67,191.77 157.48,195.58 157.48,196.85 158.75,198.12 158.75,203.2 158.43,203.52 F.J1
  Bottom 0.406: E2.52 153.67,133.35 v153.67,135.89
!ADLK_DIS  (via drill 0.81)
  Top 0.406: v148.59,195.58 148.59,205.1 F.E1 | E1.39 60.96,114.3 60.96,115.57 68.58,123.19 v68.58,140.97 | v133.35,140.97 v133.35,191.77
  Bottom 0.406: H.V2 127.95,204.79 128.27,204.47 128.27,194.31 130.81,191.77 v133.35,191.77 144.78,191.77 v148.59,195.58 | v68.58,140.97 v133.35,140.97
!CARRY_OUT  (via drill 0.81)
  Top 0.406: v167.64,195.58 167.64,128.27 v162.56,123.19
  Bottom 0.406: F.M2 167.96,203.52 167.64,203.2 v167.64,195.58 | v162.56,123.19 158.75,123.19 E2.48
!DAD+DST  (via drill 0.81)
  Top 0.406: H.E1 86.68,204.79 86.36,204.47 R3.1 87.63,193.04 v87.63,166.37 87.63,125.73 99.06,114.3 E2.90 | E1.69 v30.48,166.37
  Bottom 0.406: v30.48,166.37 v87.63,166.37
!LEFT  (via drill 0.81)
  Top 0.406: F.D1 145.73,200.98 146.05,200.66 146.05,198.12 143.51,195.58 v143.51,135.89
  Bottom 0.406: v143.51,135.89 143.51,133.35 E2.60
!MQ0  (via drill 0.81)
  Top 0.406: v135.89,195.58 v135.89,135.89
  Bottom 0.406: F.A2 136.21,203.52 135.89,203.2 v135.89,195.58 | v135.89,135.89 135.89,133.35 E2.66
!MQ10
  Top 0.406: F.A1 136.21,197.8 134.62,196.22 E2.67
!MQ11
  Top 0.406: F.B1 139.38,203.52 139.7,203.2 139.7,196.85 137.16,194.31 E2.65
!MQ_DATA
  Top 0.406: R7.1 138.43,191.77 138.43,135.89 E2.63
  Bottom 0.406: F.B2 139.38,203.52 139.7,203.2 R7.1
!MQ_TO_BUS  (via drill 0.81)
  Top 0.406: E2.35 168.91,106.68 180.34,118.11 v180.34,195.58
  Bottom 0.406: v180.34,195.58 180.34,205.1 F.S2
!RIGHT  (via drill 0.81)
  Top 0.406: F.C1 142.56,203.52 142.24,203.2 142.24,198.12 140.97,196.85 v140.97,135.89
  Bottom 0.406: v140.97,135.89 140.97,133.35 E2.62
!SC_0  (via drill 0.81)
  Top 0.406: H.U1 124.78,204.79 124.46,204.47 v124.46,144.78 124.46,143.51 130.81,137.16 v130.81,135.89 | v59.69,120.65 60.96,120.65 64.77,124.46 v64.77,144.78
  Bottom 0.406: v130.81,135.89 130.81,133.35 E2.70 | E1.46 57.15,120.65 v59.69,120.65 | v64.77,144.78 v124.46,144.78
!SGT  (via drill 0.81)
  Top 0.406: H.F1 89.85,203.52 90.17,203.2 90.17,198.12 91.44,196.85 v91.44,163.83 91.44,124.46 96.52,119.38 E2.86 | v34.29,138.43 v34.29,163.83 34.29,166.37 20.32,180.34 20.32,203.2 20,203.52 J.F1
  Bottom 0.406: E1.66 34.29,133.35 v34.29,138.43 | v34.29,163.83 v91.44,163.83
!SHL_ENA  (via drill 0.81)
  Top 0.406: v156.21,95.25 163.83,95.25 189.23,120.65 189.23,196.85 190.5,198.12 190.5,203.2 190.18,203.52 F.V1
  Bottom 0.406: E2.30 153.67,90.17 153.67,92.71 v156.21,95.25
AC0  (via drill 0.81)
  Top 0.406: v151.13,135.89 151.13,190.5 154.94,194.31 v154.94,195.58
  Bottom 0.406: E2.54 151.13,133.35 v151.13,135.89 | F.H2 155.26,204.79 154.94,204.47 v154.94,195.58
AC0_NE_AC1
  Top 0.406: E2.57 147.32,191.77 151.13,195.58 151.13,196.85 152.4,198.12 152.4,203.2 152.08,203.52 F.F1
AC1  (via drill 0.81)
  Top 0.406: E2.51 154.94,191.77 v158.75,195.58
  Bottom 0.406: F.J2 158.43,204.79 158.75,204.47 v158.75,195.58
AC2-8_0  (via drill 0.81)
  Top 0.406: E2.59 144.78,194.31 v146.05,195.58
  Bottom 0.406: F.E2 148.91,203.52 148.59,203.2 148.59,198.12 v146.05,195.58
AC4-11_0  (via drill 0.81)
  Top 0.406: v162.56,115.57 171.45,115.57 172.72,116.84 172.72,196.85 173.99,198.12 173.99,204.47 174.31,204.79 F.P1
  Bottom 0.406: E2.42 158.75,115.57 v162.56,115.57
AC_0
  Top 0.406: E2.47 168.91,121.92 170.18,123.19 170.18,196.85 171.45,198.12 171.45,205.1 F.N1
C0  (via drill 0.81)
  Top 0.406: U$1.CE1 115.25,9.84 115.57,10.16 v115.57,48.26 115.57,58.42 143.51,86.36 v143.51,87.63 | E1.22 43.18,74.93 69.85,48.26 v74.93,48.26
  Bottom 0.406: v143.51,87.63 143.51,90.17 E2.21 | v74.93,48.26 v115.57,48.26
CARRY_IN
  Top 0.406: E2.37 170.18,109.22 179.07,118.11 179.07,196.85 180.34,198.12 180.34,203.2 180.66,203.52 F.S1
CLOCK  (via drill 0.81)
  Top 0.406: H.D1 83.5,203.52 83.82,203.2 83.82,198.12 82.55,196.85 v82.55,168.91 82.55,128.27 99.06,111.76 E2.92 | E1.71 v27.94,168.91 | J.U1 54.93,204.79 54.61,204.47 v54.61,168.91
  Bottom 0.406: v27.94,168.91 v54.61,168.91 v82.55,168.91
DAD+DST  (via drill 0.81)
  Top 0.406: H.H1 93.03,203.52 92.71,203.2 92.71,198.12 93.98,196.85 v93.98,160.02 93.98,125.73 96.52,123.19 v111.76,123.19 | E1.63 v38.1,160.02
  Bottom 0.406: v111.76,123.19 115.57,123.19 E2.83 | v38.1,160.02 v93.98,160.02
DATA1
  Top 0.406: U$1.AS1 216.85,9.84 217.17,10.16 217.17,21.59 154.94,83.82 149.86,83.82 147.32,86.36 E2.24
DATA7  (via drill 0.81)
  Top 0.406: E1.24 45.72,74.93 69.85,50.8 v74.93,50.8 | U$1.BV1 137.48,8.57 137.16,8.89 v137.16,50.8
  Bottom 0.406: v137.16,50.8 v74.93,50.8
DATA8
  Top 0.406: U$1.DR1 16.51,7.62 16.51,85.09 17.78,86.36 E1.2
DATA9
  Top 0.406: U$1.DS1 13.65,8.57 13.97,8.89 13.97,83.82 16.51,86.36 16.51,90.17 E1.1
DATA10
  Top 0.406: U$1.DU1 7.3,8.57 7.62,8.89 7.62,99.06 10.16,101.6 E1.100
DATA11  (via drill 0.81)
  Top 0.406: U$1.DV1 3.81,7.94 3.81,96.52 10.16,102.87 v11.43,102.87
  Bottom 0.406: v11.43,102.87 13.97,102.87 E1.99
DATA_F  (via drill 0.81)
  Top 0.406: v162.56,120.65 168.91,120.65 171.45,123.19 v171.45,195.58
  Bottom 0.406: E2.46 158.75,120.65 v162.56,120.65 | F.N2 171.13,203.52 171.45,203.2 v171.45,195.58
DATA_T  (via drill 0.81)
  Top 0.406: E2.31 168.91,101.6 187.96,120.65 v187.96,195.58
  Bottom 0.406: v187.96,195.58 186.69,196.85 186.69,205.1 F.U2
DEFER  (via drill 0.81)
  Top 0.406: v31.75,19.05 31.75,21.59 26.67,26.67 v26.67,87.63
  Bottom 0.406: U$1.DK2 32.7,8.57 33.02,8.89 33.02,17.78 v31.75,19.05 | v26.67,87.63 26.67,90.17 E1.9
DIV_12_L  (via drill 0.81)
  Top 0.406: H.N1 108.9,202.25 109.22,201.93 v109.22,152.4 109.22,149.86 121.92,137.16 E2.77 | E1.55 v48.26,152.4
  Bottom 0.406: v48.26,152.4 v109.22,152.4
E  (via drill 0.81)
  Top 0.406: v113.03,83.82 116.84,83.82 119.38,86.36 E2.2 | v27.94,19.05 27.94,22.86 24.13,26.67 v24.13,83.82 v24.13,87.63
  Bottom 0.406: U$1.DL2 29.21,8.89 29.21,17.78 v27.94,19.05 | v24.13,87.63 24.13,90.17 E1.7 | v113.03,83.82 v24.13,83.82
EIR2  (via drill 0.81)
  Top 0.406: v121.92,195.58 v121.92,146.05 121.92,144.78 129.54,137.16 E2.71 | v60.96,123.19 63.5,125.73 v63.5,146.05
  Bottom 0.406: H.T2 121.6,203.52 121.92,203.2 v121.92,195.58 | E1.48 57.15,123.19 v60.96,123.19 | v63.5,146.05 v121.92,146.05
EIR3  (via drill 0.81)
  Top 0.406: H.S1 118.43,202.25 118.11,201.93 v118.11,148.59 118.11,146.05 127,137.16 E2.73 | E1.50 57.15,125.73 59.69,125.73 60.96,127 v60.96,148.59
  Bottom 0.406: v60.96,148.59 v118.11,148.59
EN0  (via drill 0.81)
  Top 0.406: E2.33 168.91,104.14 184.15,119.38 v184.15,195.58
  Bottom 0.406: v184.15,195.58 184.15,205.1 F.T2
EN1  (via drill 0.81)
  Top 0.406: E2.39 170.18,111.76 173.99,115.57 v173.99,195.58
  Bottom 0.406: v173.99,195.58 173.99,205.1 F.P2
EN2  (via drill 0.81)
  Top 0.406: v162.56,92.71 190.5,120.65 v190.5,195.58
  Bottom 0.406: E2.29 156.21,92.71 v162.56,92.71 | F.V2 190.18,204.79 190.5,204.47 v190.5,195.58
FD_SET  (via drill 0.81)
  Top 0.406: v163.83,189.23 163.83,196.85 165.1,198.12 165.1,203.2 164.78,203.52 F.L1 | v59.69,118.11 66.04,124.46 v66.04,143.51 | v129.54,143.51 v129.54,189.23
  Bottom 0.406: H.U2 124.78,203.52 124.46,203.2 124.46,194.31 v129.54,189.23 v163.83,189.23 | E1.44 57.15,118.11 v59.69,118.11 | v66.04,143.51 v129.54,143.51
FE_SET  (via drill 0.81)
  Top 0.406: H.V1 127.95,203.52 128.27,203.2 128.27,198.12 127,196.85 v127,195.58 | v166.37,190.5 166.37,196.85 167.64,198.12 167.64,205.1 F.M1 | E1.43 60.96,116.84 67.31,123.19 v67.31,142.24 | v132.08,142.24 v132.08,190.5
  Bottom 0.406: v127,195.58 127,193.04 129.54,190.5 v132.08,190.5 v166.37,190.5 | v67.31,142.24 v132.08,142.24
FETCH  (via drill 0.81)
  Top 0.406: v111.76,82.55 116.84,82.55 120.65,86.36 v120.65,87.63 | v35.56,19.05 35.56,20.32 29.21,26.67 v29.21,82.55 v29.21,87.63
  Bottom 0.406: U$1.DJ2 35.56,8.89 v35.56,19.05 | v120.65,87.63 120.65,90.17 E2.3 | v29.21,87.63 29.21,90.17 E1.11 | v111.76,82.55 v29.21,82.55
GND  (via drill 0.81, 0.81 pad 0.3)
  Top 0.813: U$1.DT1 10.16,8.89 v10.16,22.86 | v195.58,22.86 C34.- 185.42,8.89 U$1.BC2 | U$1.DN1 22.86,7.62 v22.86,22.86 | U$1.DF1 41.91,8.89 v41.91,22.86 | U$1.DC1 52.07,8.89 v52.07,22.86 | v134.62,22.86 C35.- 121.92,8.89 U$1.CC2 | U$1.CN1 92.71,8.89 v92.71,22.86 | U$1.BF2 175.26,8.89 v175.26,22.86 | U$1.BN1 156.21,8.89 v156.21,22.86 | U$1.BT1 143.51,8.89 v143.51,22.86 C4.2 147.32,80.01 v147.32,82.55 | U$1.AT1 213.68,8.57 213.36,8.89 v213.36,22.86 | U$1.AN1 226.38,8.57 226.06,8.89 v226.06,22.86 | U$1.AF1 245.43,8.57 245.11,8.89 v245.11,22.86 | F.K1 161.61,204.79 161.29,204.47 161.29,198.12 v162.56,196.85 | v142.24,195.58 v142.24,186.69 | E1.88 5.08,116.84 C6.2 v11.43,105.41 | v50.8,78.74 E1.28 | v142.24,140.97 E2.61 | C2.2 v152.4,157.48 v152.4,167.64 v152.4,186.69 | 203.2,106.68 SV1.10 180.34,86.36 154.94,86.36 E2.28 | 203.2,106.68 203.2,114.3 SV1.2 | J.V1 58.1,203.52 58.42,203.2 58.42,195.58 v55.88,195.58 | J.C2 10.48,204.79 10.16,204.47 v10.16,195.58 | J.E1 16.83,204.79 16.51,204.47 v16.51,195.58 | J.H1 23.18,204.79 22.86,204.47 v22.86,195.58 | J.R1 45.4,204.79 45.72,204.47 v45.72,195.58 | J.T1 51.75,204.79 52.07,204.47 v52.07,195.58 | v193.04,124.46 v193.04,142.24 | SV2.2 215.9,114.3 215.9,109.22 SV2.10 210.82,104.14 205.74,104.14 203.2,106.68
  Bottom 0.61: E1.97 13.97,105.41 v11.43,105.41
  Bottom 0.813: v10.16,22.86 v22.86,22.86 v41.91,22.86 v52.07,22.86 v92.71,22.86 C35.- 121.92,8.89 U$1.CC2 | v245.11,22.86 C33.- 255.27,10.16 U$1.AC2 | v245.11,22.86 v226.06,22.86 | v226.06,22.86 v213.36,22.86 | v213.36,22.86 v195.58,22.86 | v134.62,22.86 v143.51,22.86 v156.21,22.86 v175.26,22.86 | U$1.BF2 175.26,8.89 v175.26,22.86 | U$1.BC2 185.42,8.89 C34.- v175.26,22.86 | U$1.AT1 213.68,8.57 213.36,8.89 v213.36,22.86 | U$1.AN1 226.38,8.57 226.06,8.89 v226.06,22.86 | U$1.AF1 245.43,8.57 245.11,8.89 v245.11,22.86 | H.J2 96.2,203.52 96.52,203.2 96.52,196.85 97.79,195.58 99.06,195.58 | 99.06,195.58 102.87,195.58 | 102.87,195.58 105.41,195.58 | 105.41,195.58 109.22,195.58 | 109.22,195.58 111.76,195.58 | 111.76,195.58 115.57,195.58 | 115.57,195.58 118.11,195.58 | 118.11,195.58 118.11,205.1 H.S2 | H.K2 99.38,204.79 99.06,204.47 99.06,195.58 | H.L2 102.55,204.79 102.87,204.47 102.87,195.58 | H.M2 105.73,203.52 105.41,203.2 105.41,195.58 | H.N2 108.9,204.79 109.22,204.47 109.22,195.58 | H.P2 112.08,204.79 111.76,204.47 111.76,195.58 | H.R2 115.25,204.79 115.57,204.47 115.57,195.58 | 118.11,195.58 118.11,186.69 | 118.11,186.69 v142.24,186.69 v152.4,186.69 165.1,186.69 168.91,190.5 168.91,191.77 167.64,193.04 165.1,193.04 163.83,194.31 v162.56,196.85 | F.C2 142.56,204.79 142.24,204.47 142.24,198.12 144.78,198.12 | 144.78,198.12 146.05,198.12 146.05,205.1 F.D2 | 144.78,198.12 v142.24,195.58 | E1.28 E1.29 53.34,93.98 50.8,93.98 | C7.2 v50.8,78.74 | E1.88 E1.85 25.4,129.54 | v147.32,82.55 147.32,83.82 E2.28 | E2.28 E2.27 152.4,93.98 | C5.2 48.26,144.78 40.64,137.16 E1.61 E1.62 40.64,129.54 | C8.2 63.5,109.22 E1.37 E1.40 50.8,106.68
  Bottom 0.813: E1.45 63.5,119.38 C8.2 | 109.22,116.84 C1.2 72.39,110.49 C8.2 | E2.45 165.1,119.38 167.64,116.84 167.64,110.49 C3.2 165.1,91.44 160.02,86.36 154.94,86.36 E2.28 | J.C2 10.48,204.79 10.16,204.47 v10.16,195.58 v16.51,195.58 | v16.51,195.58 16.51,204.47 16.83,204.79 J.E1 | J.H1 23.18,204.79 22.86,204.47 v22.86,195.58 | J.R1 45.4,203.52 45.72,203.2 v45.72,195.58 | J.T1 51.75,204.79 52.07,204.47 v52.07,195.58 | v52.07,195.58 v45.72,195.58 | v52.07,195.58 v55.88,195.58 55.88,193.04 62.23,186.69 118.11,186.69 | v16.51,195.58 v22.86,195.58 | v22.86,195.58 v45.72,195.58 | SV1.2 v193.04,124.46 | v193.04,142.24 190.5,144.78 C2.2 146.05,144.78 v142.24,140.97 138.43,140.97 135.89,138.43 113.03,138.43 109.22,134.62 109.22,116.84 | 109.22,116.84 E2.88 | E2.97 127,93.98 134.62,93.98 | 134.62,93.98 E2.13 | 134.62,93.98 152.4,93.98 | E2.40 152.4,106.68 | 152.4,106.68 152.4,93.98 | 40.64,129.54 25.4,129.54 | 25.4,129.54 E1.76 | 40.64,129.54 50.8,121.92 50.8,106.68 | E1.13 33.02,93.98 50.8,93.98 | 50.8,106.68 50.8,93.98 | E2.76 127,129.54 149.86,129.54 152.4,127 152.4,106.68
  pour Bottom: 0,17.78 0,196.85 265.43,196.85 265.43,156.84 260.35,156.84 260.35,77.47 265.43,77.47 265.43,16.51
GTF+IND  (via drill 0.81)
  Top 0.406: H.A1 73.98,203.52 73.66,203.2 73.66,197.49 69.85,193.68 v69.85,184.15 69.85,133.35 101.6,101.6 E2.100 | J.S1 48.58,203.52 48.26,203.2 v48.26,184.15
  Bottom 0.406: v48.26,184.15 v69.85,184.15
INCR_SC  (via drill 0.81)
  Top 0.406: H.K1 99.38,203.52 99.06,203.2 v99.06,156.21 118.11,137.16 118.11,133.35 E2.80 | v44.45,135.89 v44.45,156.21
  Bottom 0.406: E1.58 44.45,133.35 v44.45,135.89 | v44.45,156.21 v99.06,156.21
INIT  (via drill 0.81)
  Top 0.406: U$1.CR1 86.68,8.57 86.36,8.89 v86.36,40.64 86.36,41.91 129.54,85.09 E2.10 | E1.14 33.02,78.74 71.12,40.64 v74.93,40.64
  Bottom 0.406: v74.93,40.64 v86.36,40.64
INT_IN_PROG  (via drill 0.81)
  Top 0.406: v46.99,87.63 46.99,74.93 69.85,52.07 v73.66,52.07 | v152.4,19.05 v152.4,52.07
  Bottom 0.406: E1.25 46.99,90.17 v46.99,87.63 | U$1.BP2 153.35,8.57 153.67,8.89 153.67,17.78 v152.4,19.05 | v152.4,52.07 v73.66,52.07
LAST_STEP_L  (via drill 0.81)
  Top 0.406: H.C1 80.01,203.2 80.01,198.12 78.74,196.85 R9.1 78.74,190.5 77.47,189.23 v77.47,171.45 77.47,130.81 100.33,107.95 v111.76,107.95 | E1.73 v25.4,171.45
  Bottom 0.406: v111.76,107.95 115.57,107.95 E2.95 | v25.4,171.45 v77.47,171.45
LINK  (via drill 0.81)
  Top 0.406: v207.01,19.05 207.01,25.4 146.05,86.36 v146.05,87.63
  Bottom 0.406: U$1.AV2 207.01,8.26 v207.01,19.05 | v146.05,87.63 146.05,90.17 E2.23
LINK_DATA  (via drill 0.81)
  Top 0.406: v85.09,19.05 85.09,41.91 128.27,85.09 v128.27,87.63
  Bottom 0.406: U$1.CR2 86.68,8.57 86.36,8.89 86.36,17.78 v85.09,19.05 | v128.27,87.63 128.27,90.17 E2.9
LINK_LOAD  (via drill 0.81)
  Top 0.406: v82.55,19.05 82.55,41.91 125.73,85.09 125.73,89.53 E2.7
  Bottom 0.406: U$1.CS2 83.82,10.16 83.82,17.78 v82.55,19.05
MA_MS_LC  (via drill 0.81)
  Top 0.406: v59.69,102.87 60.96,102.87 62.23,101.6 62.23,66.04 69.85,58.42 v74.93,58.42 | v172.72,57.15 v172.72,19.05
  Bottom 0.406: E1.32 57.15,102.87 v59.69,102.87 | v74.93,58.42 171.45,58.42 v172.72,57.15 | U$1.BH2 172.4,8.57 172.72,8.89 v172.72,19.05
MD0  (via drill 0.81)
  Top 0.406: U$1.AK1 235.9,8.57 236.22,8.89 v236.22,63.5 | v60.96,107.95 67.31,101.6 67.31,66.04 69.85,63.5 v74.93,63.5
  Bottom 0.406: v236.22,63.5 v74.93,63.5 | E1.38 57.15,107.95 v60.96,107.95
MD1  (via drill 0.81)
  Top 0.406: U$1.AL1 232.73,8.57 232.41,8.89 v232.41,62.23 | E1.35 60.96,106.68 66.04,101.6 66.04,66.04 69.85,62.23 v73.66,62.23
  Bottom 0.406: v232.41,62.23 v73.66,62.23
MD2  (via drill 0.81)
  Top 0.406: U$1.AM1 229.55,8.57 229.87,8.89 v229.87,60.96 | v59.69,105.41 60.96,105.41 64.77,101.6 64.77,66.04 69.85,60.96 v74.93,60.96
  Bottom 0.406: v229.87,60.96 v74.93,60.96 | E1.34 57.15,105.41 v59.69,105.41
MD3  (via drill 0.81)
  Top 0.406: U$1.AP1 223.2,8.57 223.52,8.89 v223.52,59.69 | E1.33 60.96,104.14 63.5,101.6 63.5,66.04 69.85,59.69 v73.66,59.69
  Bottom 0.406: v73.66,59.69 v223.52,59.69
MD4  (via drill 0.81)
  Top 0.406: U$1.BK1 166.05,8.57 166.37,8.89 v166.37,57.15 | v73.66,57.15 69.85,57.15 60.96,66.04 60.96,99.06 E1.31
  Bottom 0.406: v166.37,57.15 v73.66,57.15
MD5  (via drill 0.81)
  Top 0.406: E1.30 53.34,72.39 69.85,55.88 v74.93,55.88 | U$1.BL1 162.88,8.57 162.56,8.89 v162.56,55.88
  Bottom 0.406: v162.56,55.88 v74.93,55.88
MD6  (via drill 0.81)
  Top 0.406: v49.53,87.63 49.53,74.93 69.85,54.61 v73.66,54.61 | U$1.BM1 159.7,8.57 160.02,8.89 v160.02,54.61
  Bottom 0.406: E1.27 49.53,90.17 v49.53,87.63 | v160.02,54.61 v73.66,54.61
MD7  (via drill 0.81)
  Top 0.406: E1.26 48.26,74.93 69.85,53.34 v74.93,53.34 | U$1.BP1 153.35,8.57 153.67,8.89 v153.67,53.34
  Bottom 0.406: v153.67,53.34 v74.93,53.34
MD8
  Top 0.406: U$1.DK1 32.7,8.57 33.02,8.89 33.02,21.59 27.94,26.67 E1.10
MD9
  Top 0.406: U$1.DL1 29.53,9.84 29.21,10.16 29.21,22.86 25.4,26.67 E1.8
MD10
  Top 0.406: U$1.DM1 26.35,8.57 26.67,8.89 26.67,22.86 20.32,29.21 E1.4
MD11  (via drill 0.81)
  Top 0.406: U$1.DP1 20,8.57 20.32,8.89 20.32,22.86 19.05,24.13 v19.05,87.63
  Bottom 0.406: v19.05,87.63 19.05,90.17 E1.3
MD_DISABLE  (via drill 0.81)
  Top 0.406: v162.56,105.41 168.91,105.41 182.88,119.38 182.88,196.85 184.15,198.12 184.15,203.2 183.83,203.52 F.T1
  Bottom 0.406: E2.34 158.75,105.41 v162.56,105.41
MODEB  (via drill 0.81)
  Top 0.406: v73.66,195.58 71.12,193.04 v71.12,176.53 71.12,133.35 101.6,102.87 v111.76,102.87 | H.R1 115.25,204.79 115.57,204.47 v115.57,191.77 | v19.05,135.89 v19.05,176.53
  Bottom 0.406: H.A2 73.98,204.79 73.66,204.47 v73.66,195.58 74.93,194.31 74.93,191.77 v115.57,191.77 | v111.76,102.87 115.57,102.87 E2.99 | E1.78 19.05,133.35 v19.05,135.89 | v19.05,176.53 v71.12,176.53
MQ_0  (via drill 0.81)
  Top 0.406: v148.59,135.89 148.59,191.77 v152.4,195.58
  Bottom 0.406: E2.56 148.59,133.35 v148.59,135.89 | F.F2 152.08,204.79 152.4,204.47 v152.4,195.58
MQ_LOAD  (via drill 0.81)
  Top 0.406: v162.56,110.49 170.18,110.49 177.8,118.11 v177.8,195.58
  Bottom 0.406: E2.38 158.75,110.49 v162.56,110.49 | v177.8,195.58 177.8,205.1 F.R2
MSIR_DISABLE
  Top 0.406: U$1.CV1 73.66,10.16 73.66,35.56 120.65,82.55 120.65,85.09 121.92,86.36 E2.4
NEXT_LOC  (via drill 0.81)
  Top 0.406: H.P1 112.08,203.52 111.76,203.2 v113.03,149.86 125.73,137.16 v125.73,135.89 | v52.07,135.89 v52.07,149.86
  Bottom 0.406: v125.73,135.89 125.73,133.35 E2.74 | E1.52 52.07,133.35 v52.07,135.89 | v52.07,149.86 v113.03,149.86
NOT_LAST_XFER  (via drill 0.81)
  Top 0.406: U$1.CM1 96.2,9.84 96.52,10.16 96.52,46.99 135.89,86.36 v135.89,87.63
  Bottom 0.406: v135.89,87.63 135.89,90.17 E2.15
RESTART  (via drill 0.81)
  Top 0.406: v95.25,195.58 v95.25,190.5 v95.25,158.75 95.25,125.73 96.52,124.46 E2.82 | v41.91,135.89 v41.91,158.75
  Bottom 0.406: H.H2 93.03,203.52 92.71,203.2 92.71,198.12 v95.25,195.58 | E1.60 41.91,133.35 v41.91,135.89 | v41.91,158.75 v95.25,158.75 | J.V2 58.1,203.52 58.42,203.2 58.42,193.04 60.96,190.5 v95.25,190.5
ROM_11_L  (via drill 0.81)
  Top 0.406: R5.1 85.09,191.77 v85.09,167.64 85.09,127 99.06,113.03 v111.76,113.03 | v29.21,138.43 v29.21,167.64
  Bottom 0.406: H.D2 83.82,201.93 R5.1 | v111.76,113.03 115.57,113.03 E2.91 | E1.70 29.21,133.35 v29.21,138.43 | v29.21,167.64 v85.09,167.64
ROM_12_L  (via drill 0.81)
  Top 0.406: v77.47,195.58 R2.1 74.93,191.77 v74.93,172.72 74.93,132.08 100.33,106.68 E2.96 | v24.13,138.43 v24.13,172.72
  Bottom 0.406: H.B2 77.15,203.52 77.47,203.2 v77.47,195.58 | E1.74 24.13,133.35 v24.13,138.43 | v24.13,172.72 v74.93,172.72
ROM_13_L  (via drill 0.81)
  Top 0.406: H.L1 102.87,204.47 102.87,198.12 101.6,196.85 R12.1 102.87,191.77 v102.87,154.94 102.87,153.67 119.38,137.16 E2.79 | E1.57 v45.72,154.94
  Bottom 0.406: v45.72,154.94 v102.87,154.94
ROM_14_L  (via drill 0.81)
  Top 0.406: H.B1 77.47,204.47 77.47,198.12 74.93,195.58 74.93,194.31 R6.1 72.39,191.77 v72.39,175.26 72.39,133.35 101.6,104.14 E2.98 | E1.77 v20.32,175.26
  Bottom 0.406: v20.32,175.26 v72.39,175.26
ROM_15_L  (via drill 0.81)
  Top 0.406: R8.1 88.9,191.77 v88.9,165.1 88.9,125.73 99.06,115.57 v111.76,115.57 | E1.67 v33.02,165.1
  Bottom 0.406: H.E2 86.36,203.2 86.36,196.85 90.17,194.31 R8.1 | v111.76,115.57 115.57,115.57 E2.89 | v33.02,165.1 v88.9,165.1
ROM_17_L  (via drill 0.81)
  Top 0.406: R4.1 80.01,191.77 v80.01,170.18 80.01,129.54 100.33,109.22 E2.94 | v26.67,138.43 v26.67,170.18
  Bottom 0.406: H.C2 80.01,203.2 80.01,198.12 81.28,196.85 R4.1 | E1.72 26.67,133.35 v26.67,138.43 | v26.67,170.18 v80.01,170.18
ROM_22_L  (via drill 0.81)
  Top 0.406: H.J1 96.52,203.2 R1.1 97.79,191.77 v97.79,157.48 97.79,127 99.06,125.73 115.57,125.73 E2.81 | E1.59 v43.18,157.48
  Bottom 0.406: v43.18,157.48 v97.79,157.48
ROM_24_L  (via drill 0.81)
  Top 0.406: H.M1 105.73,203.52 105.41,203.2 105.41,198.12 106.68,196.85 R11.1 107.95,191.77 v107.95,153.67 107.95,149.86 120.65,137.16 v120.65,135.89 | v46.99,138.43 v46.99,153.67
  Bottom 0.406: E2.78 120.65,133.35 v120.65,135.89 | E1.56 46.99,133.35 v46.99,138.43 | v46.99,153.67 v107.95,153.67
RTF  (via drill 0.81)
  Top 0.406: H.T1 121.6,202.25 121.92,201.93 121.92,198.12 120.65,196.85 v120.65,147.32 120.65,144.78 128.27,137.16 v128.27,135.89 | E1.49 60.96,124.46 62.23,125.73 v62.23,147.32 | v13.97,176.53 13.97,203.2 13.65,203.52 J.D1
  Bottom 0.406: v128.27,135.89 128.27,133.35 E2.72 | v120.65,147.32 v62.23,147.32 43.18,147.32 v13.97,176.53
SKIP
  Top 0.406: U$1.CS1 83.82,8.89 83.82,41.91 127,85.09 E2.8
TCK1  (via drill 0.81)
  Top 0.406: v36.83,138.43 v36.83,161.29 | SV1.1 v198.12,123.19
  Bottom 0.406: E1.64 36.83,133.35 v36.83,138.43 | v36.83,161.29 180.34,161.29 198.12,143.51 v198.12,123.19
TCK2  (via drill 0.81)
  Top 0.406: v209.55,121.92 196.85,134.62 v196.85,139.7
  Bottom 0.406: SV2.1 209.55,118.11 v209.55,121.92 | E2.64 138.43,133.35 138.43,139.7 v196.85,139.7
TDI1  (via drill 0.81)
  Top 0.406: v22.86,73.66 E1.6
  Bottom 0.406: SV1.9 165.1,73.66 v22.86,73.66
TDI2  (via drill 0.81)
  Top 0.406: E2.6 124.46,86.36 v121.92,83.82 | v163.83,80.01 v184.15,80.01
  Bottom 0.406: v121.92,83.82 125.73,80.01 v163.83,80.01 | v184.15,80.01 SV2.9
TDO1  (via drill 0.81)
  Top 0.406: SV1.3 199.39,115.57 v199.39,124.46 | E1.75 v22.86,173.99
  Bottom 0.406: v199.39,124.46 199.39,143.51 170.18,172.72 168.91,173.99 149.86,173.99 v22.86,173.99
TDO2  (via drill 0.81)
  Top 0.406: E2.75 124.46,135.89 110.49,149.86 v110.49,151.13 | v208.28,120.65 195.58,133.35 v195.58,142.24
  Bottom 0.406: SV2.3 208.28,116.84 v208.28,120.65 | v110.49,151.13 186.69,151.13 v195.58,142.24
TMS1  (via drill 0.81)
  Top 0.406: v36.83,87.63 v36.83,80.01
  Bottom 0.406: SV1.5 165.1,78.74 53.34,78.74 52.07,80.01 v36.83,80.01 | E1.17 36.83,90.17 v36.83,87.63
TMS2  (via drill 0.81)
  Top 0.406: v165.1,81.28 v180.34,81.28
  Bottom 0.406: E2.17 138.43,90.17 138.43,82.55 139.7,81.28 v165.1,81.28 | SV2.5 v180.34,81.28
TP  (via drill 0.81)
  Top 0.406: U$1.AA1 261.3,8.57 261.62,8.89 261.62,40.64 217.17,85.09 149.86,85.09 148.59,86.36 v148.59,87.63
  Bottom 0.406: v148.59,87.63 148.59,90.17 E2.25
TP1  (via drill 0.81)
  Top 0.406: v118.11,19.05 v118.11,49.53 118.11,59.69 144.78,86.36 E2.22 | v44.45,87.63 44.45,74.93 69.85,49.53 v73.66,49.53
  Bottom 0.406: U$1.CD2 118.43,8.57 118.11,8.89 v118.11,19.05 | E1.23 44.45,90.17 v44.45,87.63 | v73.66,49.53 v118.11,49.53
TP2  (via drill 0.81)
  Top 0.406: v114.3,19.05 v114.3,46.99 114.3,59.69 140.97,86.36 v140.97,87.63 | v39.37,87.63 39.37,77.47 69.85,46.99 v73.66,46.99
  Bottom 0.406: U$1.CE2 115.25,8.57 115.57,8.89 115.57,17.78 v114.3,19.05 | v140.97,87.63 140.97,90.17 E2.19 | E1.19 39.37,90.17 v39.37,87.63 | v73.66,46.99 v114.3,46.99
TP2_D  (via drill 0.81)
  Top 0.406: v92.71,195.58 v92.71,162.56 92.71,124.46 96.52,120.65 v111.76,120.65 | E1.65 v35.56,162.56
  Bottom 0.406: H.F2 89.85,204.79 90.17,204.47 90.17,198.12 v92.71,195.58 | v111.76,120.65 115.57,120.65 E2.85 | v35.56,162.56 v92.71,162.56
TP3  (via drill 0.81)
  Top 0.406: v109.22,19.05 v109.22,45.72 109.22,55.88 139.7,86.36 E2.18 | E1.18 38.1,77.47 69.85,45.72 v74.93,45.72
  Bottom 0.406: U$1.CH2 108.9,8.57 109.22,8.89 v109.22,19.05 | v74.93,45.72 v109.22,45.72
TP4  (via drill 0.81)
  Top 0.406: v105.41,19.05 v105.41,44.45 | v73.66,44.45 71.12,44.45 69.85,44.45 35.56,78.74 E1.16
  Bottom 0.406: U$1.CJ2 105.73,8.57 105.41,8.89 v105.41,19.05 | v105.41,44.45 v73.66,44.45
TS2  (via drill 0.81)
  Top 0.406: v99.06,19.05 99.06,48.26 137.16,86.36 E2.16
  Bottom 0.406: U$1.CL2 99.38,8.57 99.06,8.89 v99.06,19.05
TS3  (via drill 0.81)
  Top 0.406: v95.25,19.05 v95.25,43.18 95.25,46.99 134.62,86.36 E2.14 | v34.29,87.63 34.29,78.74 69.85,43.18 v74.93,43.18
  Bottom 0.406: U$1.CM2 96.2,9.84 96.52,10.16 96.52,17.78 v95.25,19.05 | E1.15 34.29,90.17 v34.29,87.63 | v74.93,43.18 v95.25,43.18
TS4  (via drill 0.81)
  Top 0.406: v90.17,19.05 90.17,44.45 130.81,85.09 v130.81,87.63
  Bottom 0.406: U$1.CP2 89.85,9.84 90.17,10.16 v90.17,19.05 | v130.81,87.63 130.81,90.17 E2.11
VCC
  Top 0.813: C35.+ VCCINT.1 VCCIO.1
  Bottom 0.813: 261.62,25.4 261.62,36.83 C33.+ 255.27,72.39 SV2.4 215.9,116.84 215.9,124.46 | 261.62,25.4 261.62,8.89 U$1.AA2 | U$1.BA2 191.77,8.89 191.77,25.4 | 191.77,25.4 261.62,25.4 | U$1.CA2 128.27,8.89 128.27,25.4 | 128.27,25.4 187.96,25.4 | 187.96,25.4 191.77,25.4 | 128.27,25.4 128.27,36.83 C35.+ | C34.+ 187.96,40.64 187.96,25.4 | R6.2 76.2,182.88 | R2.2 76.2,182.88 | 76.2,182.88 R9.2 R4.2 R5.2 86.36,182.88 | R3.2 86.36,182.88 | 86.36,182.88 R8.2 R1.2 R12.2 R11.2 R7.2 R18.2 215.9,129.54 215.9,124.46 | SV1.4 205.74,114.3 205.74,124.46 215.9,124.46
VCCINT  (via drill 0.81)
  Top 0.813: C3.1 E2.41 | E1.42 E1.41 | C6.1 E1.90 | C8.1 v68.58,107.95 | VCCINT.2 v125.73,64.77 | v91.44,64.77 v91.44,107.95
  Bottom 0.61: C1.1 115.57,110.49 E2.93
  Bottom 0.813: E1.91 E1.92 E1.90 E1.89 | E1.91 E1.89 | E1.89 E1.87 | E1.91 E1.93 | E1.41 C8.1 | v68.58,107.95 v91.44,107.95 106.68,107.95 C1.1 | v125.73,64.77 v91.44,64.77
VCCIO
  Top 0.813: VCCIO.2 130.81,69.85 C4.1 | C7.1 E1.20 E1.21 | E1.54 E1.53 C5.1
  Bottom 0.61: C4.1 142.24,83.82 E2.20 | E2.5 125.73,90.17 125.73,85.09
  Bottom 0.813: E1.84 E1.83 | C2.1 E2.53 | C7.1 125.73,85.09

### Text on the board
Top: CS*A B C D E F H J K L M N P R S T U V W X Y Z | + | + | +
Bottom: KE8E | EXTENDED ARITHMETIC ELEMENT
tPlace: M8341 | M8340 | M8341 | M8341 | M8341 | M8340 | M8341 | M8341 | M8341 | M8341 | M8341 | M8341 | M8340 | M8341